# EAGLE schematic Resnik (EAGLE 9.6.1)

## Sheet 1 of 6
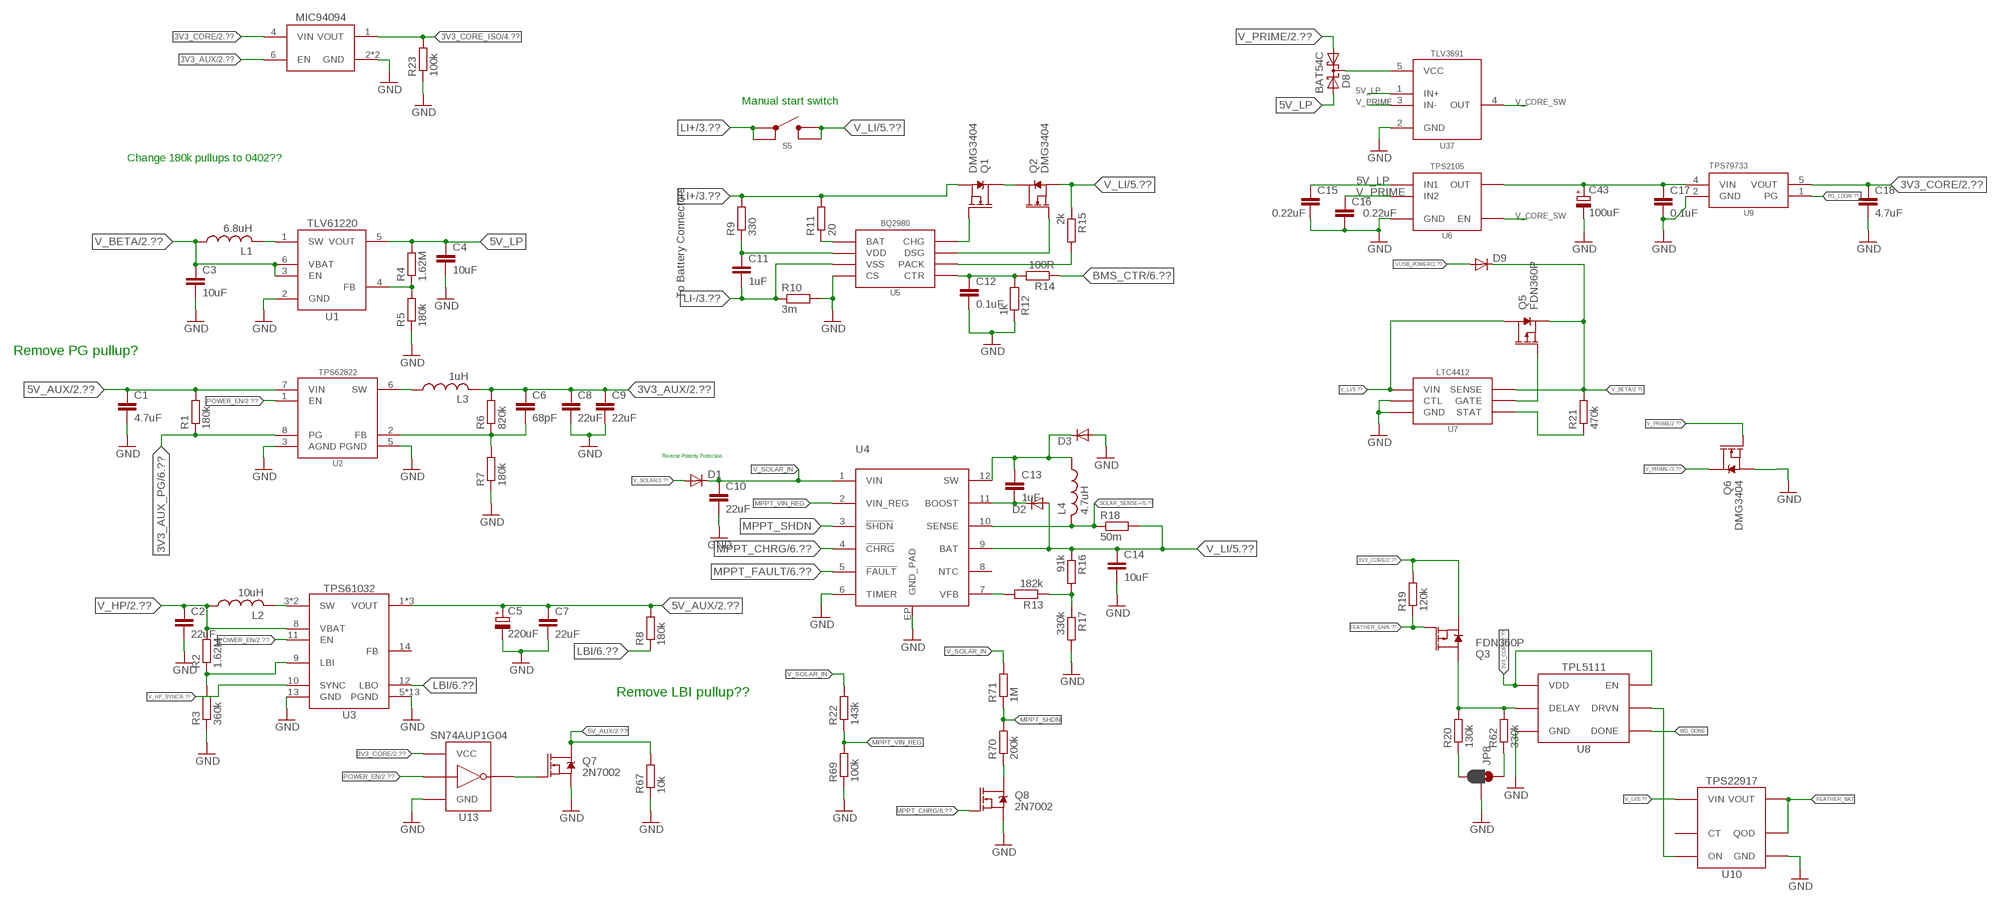
[diagram p0: schematic, sheet 1]

### Parts
C1  4.7uF  C-EU4.7UFC0805  [C0805]
C2  22uF  C-EU22UFC0805  [C0805]
C3  10uF  C-EU10UFC0805  [C0805]
C4  10uF  C-EU10UFC0805  [C0805]
C5  220uF  CTANT_EU2917  [C2917]
C6  68pF  C-EU68PFC0402  [C0402]
C7  22uF  C-EU22UFC0805  [C0805]
C8  22uF  C-EU22UFC0805  [C0805]
C9  22uF  C-EU22UFC0805  [C0805]
C10  22uF  C-EU22UFC0805  [C0805]
C11  1uF  C-EU1UFC0603  [C0603]
C12  0.1uF  C-EU0.1UFC0402  [C0402]
C13  1uF  C-EU1UFC0603  [C0603]
C14  10uF  C-EU10UFC0805  [C0805]
C15  0.22uF  C-EU0.22UFC0402  [C0402]
C16  0.22uF  C-EU0.22UFC0402  [C0402]
C17  0.1uF  C-EU0.1UFC0402  [C0402]
C18  4.7uF  C-EU4.7UFC0603  [C0603]
C43  100uF  CTANT_EU1206  [C1206_TANT]
D1  DIODEDO-214AC  [DO214AC]
D2  DIODESOD-323  [SOD323-R]
D3  DIODEDO-214AC  [DO214AC]
D8  BAT54C  [SOT23-3]
D9  DIODEDO-214AC  [DO214AC]
JP8  JUMPER-SMT_3_1-NC_PASTE_SILK  [SMT-JUMPER_3_1-NC_PASTE_SILK]
L1  6.8uH  INDUCTOR1008  [1008]
L2  10uH  INDUCTORXHMI_6.65X6.45  [WE-XHMI(6.65X6.45)]
L3  1uH  INDUCTORLQS_3X3  [WE-LQS(3X3)]
L4  4.7uH  INDUCTORMAIA_4.1X4.1  [WE-MAIA(4.1X4.1)]
Q1  DMG3404  MOSFET-NCH-DMG3404L  [SOT23-3]
Q2  DMG3404  MOSFET-NCH-DMG3404L  [SOT23-3]
Q3  FDN360P  MOSFET_PCH-FDN360P  [SOT23-3]
Q5  FDN360P  MOSFET_PCH-FDN360P  [SOT23-3]
Q6  DMG3404  MOSFET-NCH-DMG3404L  [SOT23-3]
Q7  2N7002  MOSFET-NCH-2N7002PW  [SOT323]
Q8  2N7002  MOSFET-NCH-2N7002PW  [SOT323]
R1  180k  R-EU_180KR0603  [R0603]
R2  1.62M  R-EU_1.62MR0603  [R0603]
R3  360k  R-EU_360KR0603  [R0603]
R4  1.62M  R-EU_1.62MR0603  [R0603]
R5  180k  R-EU_180KR0603  [R0603]
R6  820k  R-EU_820KR0603  [R0603]
R7  180k  R-EU_180KR0603  [R0603]
R8  180k  R-EU_180KR0603  [R0603]
R9  330  R-EU_330R0402  [R0402]
R10  3m  R-EU_0.003R0805  [R0805]
R11  20  R-EU_20R0402  [R0402]
R12  1k  R-EU_1KR0402  [R0402]
R13  182k  R-EU_182KR0603  [R0603]
R14  100R  R-EU_100R0402  [R0402]
R15  2k  R-EU_2KR0402  [R0402]
R16  91k  R-EU_91KR0603  [R0603]
R17  330k  R-EU_330KR0603  [R0603]
R18  50m  R-EU_0.05R0805  [R0805]
R19  120k  R-EU_120KR0402  [R0402]
R20  130k  R-EU_130KR0603  [R0603]
R21  470k  R-EU_470KR0603  [R0603]
R22  143k  R-EU_143KR0603  [R0603]
R23  100k  R-EU_100KR0402  [R0402]
R62  330k  R-EU_330KR0603  [R0603]
R67  10k  R-EU_10KR0402  [R0402]
R69  100k  R-EU_100KR0603  [R0603]
R70  200k  R-EU_200KR0603  [R0603]
R71  1M  R-EU_1MR0603  [R0603]
S5  BUTTON2.6X1.6  [SWITCH_2.6X1.6]
U1  TLV61220DBV  [DBV_R-PDSO-G6]
U2  TPS62822DLC  [DLC_8]
U3  TPS61032RSA  [RSA_S-PVQFN-N16]
U4  LT3652DD  [DFN_12_3X3]
U5  BQ2980RUG  [RUG_S-PQFP-N8]
U6  TPS2105  [SOT23-5]
U7  LTC4412S6  [SOT23-6L]
U8  TPL5111DDC  [DDC_R-PDSO-G6]
U9  TPS79733  [DCK_R-PDSO-G5]
U10  TPS22917DBV  [DBV_R-PDSO-G6]
U13  SN74AUP1G04YFP  [DSBGD_4]
U37  TLV3691DCK  [DCK_R-PDSO-G5]
U39  MIC94094C6  [SC-70_6]

### Nets
3V3_AUX: C6.1 C8.1 C9.1 L3.P$2 R6.2 U39.6(EN) ; also sheet 2,3,4,5
3V3_AUX_PG: R1.1 U2.8(PG) ; also sheet 6
3V3_CORE: C18.1 Q3.2(S) R19.2 U8.1(VDD) U8.6(EN) U9.5(VOUT) U13.A2(VCC) U39.4(VIN) ; also sheet 2,3,6
3V3_CORE_ISO: R23.2 U39.1(VOUT) ; also sheet 4,6
5V_AUX: C1.1 C5.+ C7.1 Q7.3(D) R1.2 R8.2 R67.2 U2.7(VIN) U3.1(VOUT) U3.15(VOUT) U3.16(VOUT) ; also sheet 2,3,4,5,6
5V_LP: C4.1 C15.1 D8.2(A2) R4.2 U1.5(VOUT) U6.5(IN1) U37.1(IN+)
BMS_CTR: R14.1 ; also sheet 6
FEATHER_BAT: U10.5(QOD) U10.6(VOUT) ; also sheet 3
FEATHER_EN: Q3.1(G) R19.1 ; also sheet 6
GND: C1.2 C2.2 C3.2 C4.2 C5.- C7.2 C8.2 C9.2 C10.2 C12.2 C14.2 C15.2 C16.2 C17.2 C18.2 C43.- D3.A JP8.2 Q6.2(S) Q7.2(S) Q8.2(S) R3.1 R5.1 R7.1 R10.2 R12.1 R17.2 R23.1 R67.1 R69.1 U1.2(GND) U2.3(AGND) U2.5(PGND) U3.5(PGND) U3.6(PGND) U3.7(PGND) U3.13(GND) U3.PAD(PGND) U3.PAD@1(PGND) U3.PAD@2(PGND) U3.PAD@3(PGND) U3.PAD@4(PGND) U3.PAD@5(PGND) U3.PAD@6(PGND) U3.PAD@7(PGND) U3.PAD@8(PGND) U3.PAD@9(PGND) U4.6(TIMER) U4.EP(GND_PAD) U5.4(CS) U6.2(GND) U7.2(GND) U7.3(CTL) U8.2(GND) U9.2(GND) U10.2(GND) U13.B1(GND) U37.2(GND) U39.2(GND) U39.5(GND) ; also sheet 2,3,4,5,6
LBI: R8.1 U3.12(LBO) ; also sheet 6
LI+: Q1.2(S) R9.2 R11.2 S5.A S5.A' ; also sheet 3
LI-: C11.2 R10.1 U5.3(VSS) ; also sheet 3,5
MPPT_CHRG: Q8.1(G) U4.4(!CHRG) ; also sheet 6
MPPT_FAULT: U4.5(!FAULT) ; also sheet 6
MPPT_SHDN: R70.2 R71.1 U4.3(!SHDN)
MPPT_VIN_REG: R22.1 R69.2 U4.2(VIN_REG)
N$2: L3.P$1 U2.6(SW)
N$3: C6.2 R6.1 R7.2 U2.2(FB)
N$4: R2.1 R3.2 U3.9(LBI)
N$5: L2.2 U3.3(SW) U3.4(SW)
N$6: Q1.3(D) Q2.3(D)
N$7: R4.1 R5.2 U1.4(FB)
N$8: Q1.1(G) U5.8(CHG)
N$9: L1.2 U1.1(SW)
N$10: Q2.1(G) U5.7(DSG)
N$11: R15.2 U5.6(PACK)
N$12: R13.1 R16.2 R17.1
N$13: C12.1 R12.2 R14.2 U5.5(CTR)
N$14: R11.1 U5.1(BAT)
N$15: R13.2 U4.7(VFB)
N$16: C11.1 R9.1 U5.2(VDD)
N$18: C13.2 D2.C U4.11(BOOST)
N$19: JP8.3 R20.1
N$20: C13.1 D3.C L4.P$1 U4.12(SW)
N$22: Q8.3(D) R70.1
N$42: JP8.1 R62.1
N$45: Q5.1(G) U7.5(GATE)
N$46: R21.1 U7.4(STAT)
N$63: Q3.3(D) R20.2 R62.2 U8.3(DELAY)
N$64: U8.5(DRVN) U10.3(ON)
N$68: Q7.1(G) U13.B2(Y)
N$69: D8.3(C) U37.5(VCC)
PG_LDO: U9.1(PG) ; also sheet 6
POWER_EN: U2.1(EN) U3.11(EN) U13.A1(A) ; also sheet 2
SOLAR_SENSE+: L4.P$2 R18.1 U4.10(SENSE) ; also sheet 5
V_BETA: C3.1 D9.C L1.1 Q5.2(S) R21.2 U1.3(EN) U1.6(VBAT) U7.6(SENSE) ; also sheet 2
V_CORE: C17.1 C43.+ U6.4(OUT) U9.4(VIN)
V_CORE_SW: U6.1(EN) U37.4(OUT)
V_HP: C2.1 L2.1 R2.2 U3.8(VBAT) ; also sheet 2
V_HP_SYNC: U3.10(SYNC) ; also sheet 6
V_LI: C14.1 D2.A Q2.2(S) Q5.3(D) R15.1 R16.1 R18.2 S5.B S5.B' U4.9(BAT) U7.1(VIN) U10.1(VIN) ; also sheet 5
V_PRIME: C16.1 D8.1(A1) Q6.1(G) U6.3(IN2) U37.3(IN-) ; also sheet 2,3,5
V_PRIME-: Q6.3(D) ; also sheet 3
V_SOLAR: D1.A ; also sheet 3
V_SOLAR_IN: C10.1 D1.C R22.2 R71.2 U4.1(VIN)
VUSB_POWER: D9.A ; also sheet 2,6
WD_DONE: U8.4(DONE) ; also sheet 3
Unconnected: U3.14(FB) U4.8(NTC) U10.4(CT)

### Notes on the sheet
- Manual start switch
- Change 180k pullups to 0402??
- To Battery Connectors
- Remove PG pullup?
- Reverse Polarity Protection
- Remove LBI pullup??

## Sheet 2 of 6
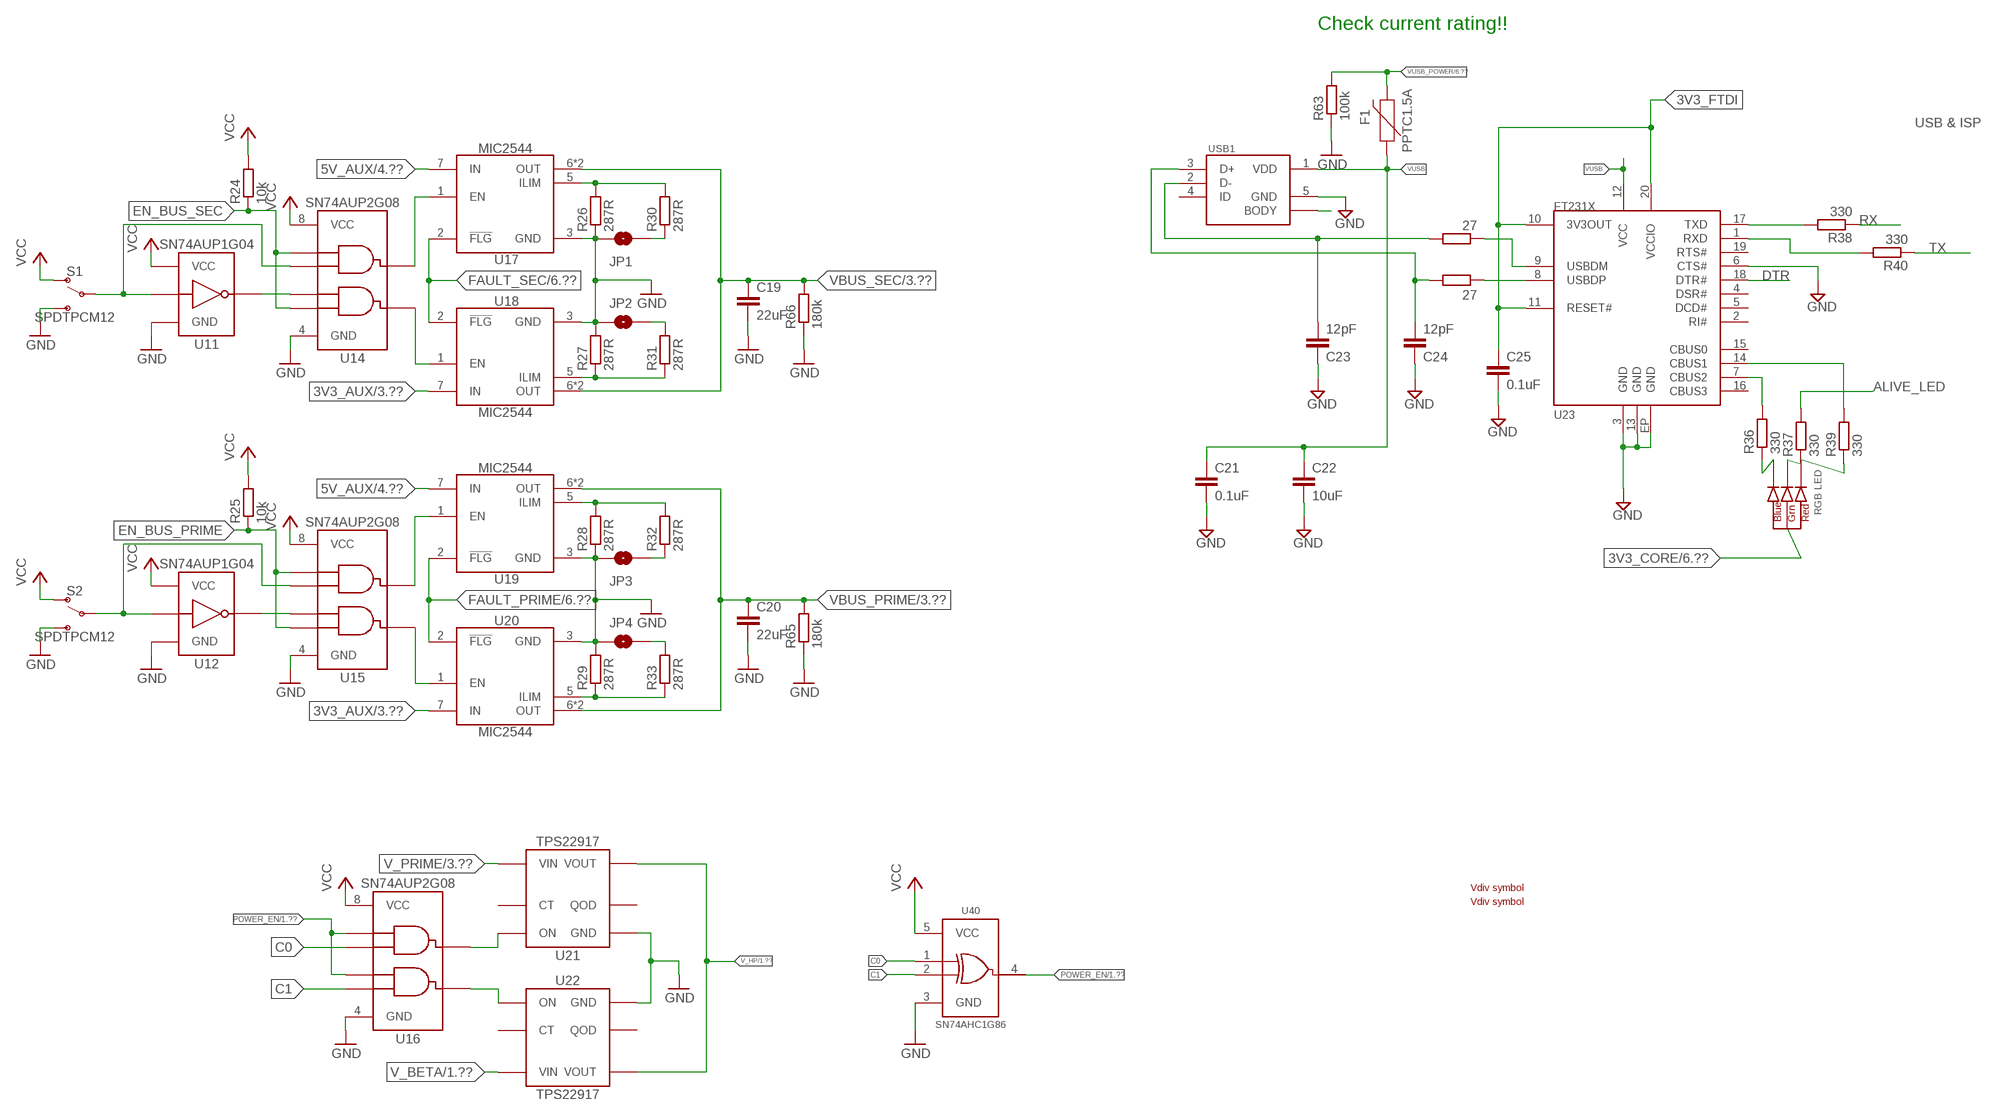
[diagram p1: schematic, sheet 2]

### Parts
C19  22uF  C-EU22UFC0805  [C0805]
C20  22uF  C-EU22UFC0805  [C0805]
C21  0.1uF  C-EU0.1UFC0402  [C0402]
C22  10uF  C-EU10UFC0805  [C0805]
C23  12pF  C-EU12PFC0402  [C0402]
C24  12pF  C-EU12PFC0402  [C0402]
C25  0.1uF  C-EU0.1UFC0402  [C0402]
D4  CLVBA-FKA  [CLVBA-FKA]
F1  PPTC1.5A  [1206]
JP1  JUMPER-SMT_2_NO_SILK  [SMT-JUMPER_2_NO_SILK]
JP2  JUMPER-SMT_2_NO_SILK  [SMT-JUMPER_2_NO_SILK]
JP3  JUMPER-SMT_2_NO_SILK  [SMT-JUMPER_2_NO_SILK]
JP4  JUMPER-SMT_2_NO_SILK  [SMT-JUMPER_2_NO_SILK]
R24  10k  R-EU_10KR0402  [R0402]
R25  10k  R-EU_10KR0402  [R0402]
R26  287R  R-EU_232R0402  [R0402]
R27  287R  R-EU_232R0402  [R0402]
R28  287R  R-EU_232R0402  [R0402]
R29  287R  R-EU_232R0402  [R0402]
R30  287R  R-EU_453R0402  [R0402]
R31  287R  R-EU_453R0402  [R0402]
R32  287R  R-EU_453R0402  [R0402]
R33  287R  R-EU_453R0402  [R0402]
R34  27  R-EU_27R0402  [R0402]
R35  27  R-EU_27R0402  [R0402]
R36  330  R-EU_330R0402  [R0402]
R37  330  R-EU_330R0402  [R0402]
R38  330  R-EU_330R0402  [R0402]
R39  330  R-EU_330R0402  [R0402]
R40  330  R-EU_330R0402  [R0402]
R63  100k  R-EU_100KR0402  [R0402]
R65  180k  R-EU_180KR0402  [R0402]
R66  180k  R-EU_180KR0402  [R0402]
S1  SPDTPCM12  [PCM12]
S2  SPDTPCM12  [PCM12]
U11  SN74AUP1G04YFP  [DSBGD_4]
U12  SN74AUP1G04YFP  [DSBGD_4]
U14  SN74AUP2G08DQE  [DQE_R-PX2SON-N8]
U15  SN74AUP2G08DQE  [DQE_R-PX2SON-N8]
U16  SN74AUP2G08DQE  [DQE_R-PX2SON-N8]
U17  MIC2544MSOP  [MSOP_8]
U18  MIC2544MSOP  [MSOP_8]
U19  MIC2544MSOP  [MSOP_8]
U20  MIC2544MSOP  [MSOP_8]
U21  TPS22917DBV  [DBV_R-PDSO-G6]
U22  TPS22917DBV  [DBV_R-PDSO-G6]
U23  FT231X-Q  [QFN20]
U40  SN74AHC1G86DCK  [DCK_R-PDSO-G5]
U$1  VDIV-JP  [VDIV_GENERIC]
U$2  VDIV-JP  [VDIV_GENERIC]
USB1  MICRO_USB_LONGPADS  [10118194-0001LF_10118194-0001LF_LONGER_PADS]

### Nets
3V3_AUX: R24.2 R25.2 S1.1(O) S2.1(O) U11.A2(VCC) U12.A2(VCC) U14.8(VCC) U15.8(VCC) U18.7(IN) U20.7(IN) ; supply symbol labelled VCC ; also sheet 1,3,4,5
3V3_CORE: D4.2(ANODE) U16.8(VCC) U40.5(VCC) ; supply symbol labelled VCC ; also sheet 1,3,6
3V3_FTDI: C25.1 U23.10(3V3OUT) U23.11(RESET#) U23.20(VCCIO)
5V_AUX: U17.7(IN) U19.7(IN) ; also sheet 1,3,4,5,6
ALIVE_LED: R37.2 ; also sheet 6
C0: U16.2(B1) U40.1(A) ; also sheet 6
C1: U16.6(B2) U40.2(B) ; also sheet 6
DTR: U23.18(DTR#) ; also sheet 6
EN_BUS_PRIME: R25.1 U15.1(A1) U15.6(B2) ; also sheet 6
EN_BUS_SEC: R24.1 U14.1(A1) U14.6(B2) ; also sheet 6
FAULT_PRIME: U19.2(!FLG) U20.2(!FLG) ; also sheet 6
FAULT_SEC: U17.2(!FLG) U18.2(!FLG) ; also sheet 6
GND: C19.2 C20.2 C21.2 C22.2 C23.1 C24.1 C25.2 JP1.1 JP2.1 JP3.1 JP4.1 R26.1 R27.2 R28.1 R29.2 R63.1 R65.1 R66.1 S1.3(S) S2.3(S) U11.B1(GND) U12.B1(GND) U14.4(GND) U15.4(GND) U16.4(GND) U17.3(GND) U18.3(GND) U19.3(GND) U20.3(GND) U21.2(GND) U22.2(GND) U23.3(GND) U23.6(CTS#) U23.13(GND) U23.EP(GND) U40.3(GND) USB1.5(GND) ; also sheet 1,3,4,5,6
N$1: USB1.BODY@1(BODY) USB1.BODY@2(BODY) USB1.BODY@3(BODY) USB1.BODY@4(BODY) USB1.BODY@7(BODY) USB1.BODY@8(BODY)
N$23: U16.7(Y1) U21.3(ON)
N$24: U16.3(Y2) U22.3(ON)
N$26: U12.B2(Y) U15.5(A2)
N$27: R28.2 R32.2 U19.5(ILIM)
N$28: S2.2(P) U12.A1(A) U15.2(B1)
N$29: U15.7(Y1) U19.1(EN)
N$30: U15.3(Y2) U20.1(EN)
N$31: JP3.2 R32.1
N$32: JP4.2 R33.2
N$33: R29.1 R33.1 U20.5(ILIM)
N$34: U11.B2(Y) U14.5(A2)
N$35: S1.2(P) U11.A1(A) U14.2(B1)
N$36: U14.7(Y1) U17.1(EN)
N$37: U14.3(Y2) U18.1(EN)
N$38: R26.2 R30.2 U17.5(ILIM)
N$39: JP1.2 R30.1
N$40: JP2.2 R31.2
N$41: R27.1 R31.1 U18.5(ILIM)
N$44: R38.2 U23.17(TXD)
N$47: R40.2 U23.1(RXD)
N$48: C24.2 R35.2 USB1.3(D+)
N$49: C23.2 R34.2 USB1.2(D-)
N$50: R35.1 U23.8(USBDP)
N$51: R39.2 U23.14(CBUS1)
N$52: R34.1 U23.9(USBDM)
N$53: D4.1(RED_CATH) R39.1
N$54: D4.3(BLUE_CATH) R36.1
N$56: D4.4(GREEN_CATH) R37.1
N$57: R36.2 U23.7(CBUS2)
POWER_EN: U16.1(A1) U16.5(A2) U40.4(Y) ; also sheet 1
RX: R38.1 ; also sheet 3,6
TX: R40.1 ; also sheet 3,6
V_BETA: U22.1(VIN) ; also sheet 1
V_HP: U21.6(VOUT) U22.6(VOUT) ; also sheet 1
V_PRIME: U21.1(VIN) ; also sheet 1,3,5
VBUS_PRIME: C20.1 R65.2 U19.6(OUT) U19.8(OUT) U20.6(OUT) U20.8(OUT) ; also sheet 3,4
VBUS_SEC: C19.1 R66.2 U17.6(OUT) U17.8(OUT) U18.6(OUT) U18.8(OUT) ; also sheet 3,4
VUSB: C21.1 C22.1 F1.1 U23.12(VCC) USB1.1(VDD)
VUSB_POWER: F1.2 R63.2 ; also sheet 1,6
Unconnected: U21.4(CT) U22.4(CT) U23.2(RI#) U23.4(DSR#) U23.5(DCD#) U23.15(CBUS0) U23.16(CBUS3) U23.19(RTS#) USB1.4(ID)

### Notes on the sheet
- Check current rating!!
- USB & ISP

## Sheet 3 of 6
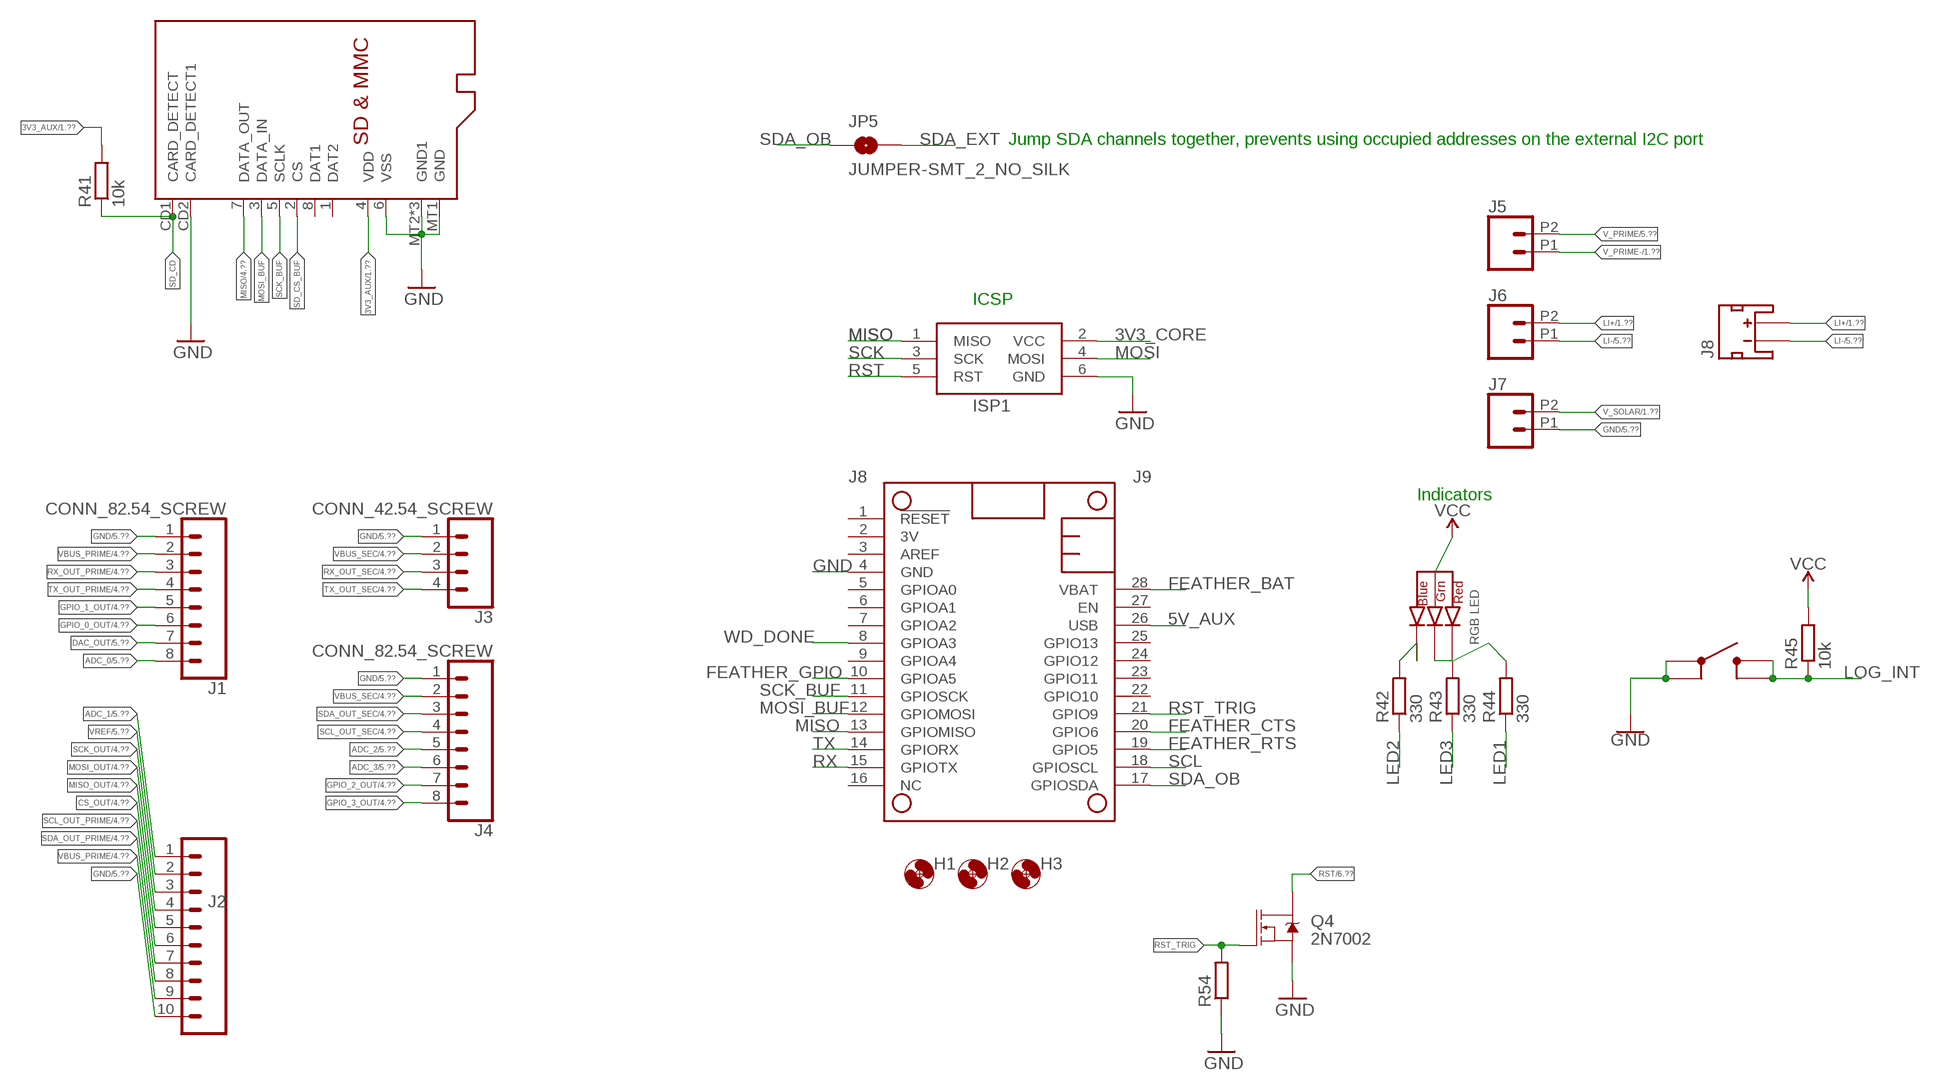
[diagram p2: schematic, sheet 3]

### Parts
D5  CLVBA-FKA  [CLVBA-FKA]
H1  MOUNTING_HOLE4_NP  [4_40]
H2  MOUNTING_HOLE4_NP  [4_40]
H3  MOUNTING_HOLE4_NP  [4_40]
ISP1  AVRISP-6  [AVRISP]
J1  CONN_82.54_SCREW  [1X08_SCREW]
J2  CONN_102.54_SCREW  [1X10_SCREW]
J3  CONN_42.54_SCREW  [1X04_SCREW]
J4  CONN_82.54_SCREW  [1X08_SCREW]
J5  CONN_022.54_SCREW  [1X02_2.54_SCREWTERM]
J6  CONN_022.54_SCREW  [1X02_2.54_SCREWTERM]
J7  CONN_022.54_SCREW  [1X02_2.54_SCREWTERM]
J8  JST_2MM_MALE  [JST-2-SMD]
JP5  JUMPER-SMT_2_NO_SILK  [SMT-JUMPER_2_NO_SILK]
MS1  FEATHERWINGLAYOUT  [FEATHERWING_MIN]
Q4  2N7002  MOSFET-NCH-2N7002PW  [SOT323]
R41  10k  R-EU_10KR0402  [R0402]
R42  330  R-EU_330R0402  [R0402]
R43  330  R-EU_330R0402  [R0402]
R44  330  R-EU_330R0402  [R0402]
R45  10k  R-EU_10KR0402  [R0402]
R54  R-EU_10KR0402  [R0402]
S3  BUTTON4.2X3.2  [SWITCH_4.2X3.2]
SD1  MICROSDCD  [MICROSD_CD]

### Nets
3V3_AUX: R41.2 SD1.4(VDD) ; also sheet 1,2,4,5
3V3_CORE: D5.2(ANODE) ISP1.2(VCC) R45.2 ; supply symbol labelled VCC ; also sheet 1,2,6
5V_AUX: MS1.26(USB) ; also sheet 1,2,4,5,6
ADC_0: J1.8 ; also sheet 5
ADC_1: J2.1 ; also sheet 5
ADC_2: J4.5 ; also sheet 5
ADC_3: J4.6 ; also sheet 5
CS_OUT: J2.6 ; also sheet 4
DAC_OUT: J1.7 ; also sheet 5
FEATHER_BAT: MS1.28(VBAT) ; also sheet 1
FEATHER_CTS: MS1.20(GPIO6) ; also sheet 6
FEATHER_GPIO: MS1.10(GPIOA5) ; also sheet 6
FEATHER_RTS: MS1.19(GPIO5) ; also sheet 6
GND: ISP1.6(GND) J1.1 J2.10 J3.1 J4.1 J7.P1 MS1.4(GND) Q4.2(S) R54.1 S3.1 S3.2 SD1.6(VSS) SD1.CD2(CARD_DETECT1) SD1.MT1(GND) SD1.MT2(GND1) SD1.MT3(GND1) SD1.MT4(GND1) ; also sheet 1,2,4,5,6
GPIO_0_OUT: J1.6 ; also sheet 4
GPIO_1_OUT: J1.5 ; also sheet 4
GPIO_2_OUT: J4.7 ; also sheet 4
GPIO_3_OUT: J4.8 ; also sheet 4
LED1: R44.1 ; also sheet 6
LED2: R42.1 ; also sheet 6
LED3: R43.1 ; also sheet 6
LI+: J6.P2 J8.2(+) ; also sheet 1
LI-: J6.P1 J8.1(-) ; also sheet 1,5
LOG_INT: R45.1 S3.3 S3.4 ; also sheet 6
MISO: ISP1.1(MISO) MS1.13(GPIOMISO) SD1.7(DATA_OUT) ; also sheet 4,6
MISO_OUT: J2.5 ; also sheet 4
MOSI: ISP1.4(MOSI) ; also sheet 4,6
MOSI_BUF: MS1.12(GPIOMOSI) SD1.3(DATA_IN) ; also sheet 4
MOSI_OUT: J2.4 ; also sheet 4
N$58: D5.3(BLUE_CATH) R42.2
N$59: D5.4(GREEN_CATH) R43.2
N$60: D5.1(RED_CATH) R44.2
RST: ISP1.5(RST) Q4.3(D) ; also sheet 6
RST_TRIG: MS1.21(GPIO9) Q4.1(G) R54.2
RX: MS1.15(GPIOTX) ; also sheet 2,6
RX_OUT_PRIME: J1.3 ; also sheet 4
RX_OUT_SEC: J3.3 ; also sheet 4
SCK: ISP1.3(SCK) ; also sheet 4,6
SCK_BUF: MS1.11(GPIOSCK) SD1.5(SCLK) ; also sheet 4
SCK_OUT: J2.3 ; also sheet 4
SCL: MS1.18(GPIOSCL) ; also sheet 4,5,6
SCL_OUT_PRIME: J2.7 ; also sheet 4
SCL_OUT_SEC: J4.4 ; also sheet 4
SD_CD: R41.1 SD1.CD1(CARD_DETECT) ; also sheet 6
SD_CS_BUF: SD1.2(CS) ; also sheet 4
SDA_EXT: JP5.2 ; also sheet 4
SDA_OB: JP5.1 MS1.17(GPIOSDA) ; also sheet 4,5,6
SDA_OUT_PRIME: J2.8 ; also sheet 4
SDA_OUT_SEC: J4.3 ; also sheet 4
TX: MS1.14(GPIORX) ; also sheet 2,6
TX_OUT_PRIME: J1.4 ; also sheet 4
TX_OUT_SEC: J3.4 ; also sheet 4
V_PRIME: J5.P2 ; also sheet 1,2,5
V_PRIME-: J5.P1 ; also sheet 1
V_SOLAR: J7.P2 ; also sheet 1
VBUS_PRIME: J1.2 J2.9 ; also sheet 2,4
VBUS_SEC: J3.2 J4.2 ; also sheet 2,4
VREF: J2.2 ; also sheet 5
WD_DONE: MS1.8(GPIOA3) ; also sheet 1
Unconnected: J8.NC1(PAD1) J8.NC2(PAD2) MS1.1(!RESET) MS1.2(3V) MS1.3(AREF) MS1.5(GPIOA0) MS1.6(GPIOA1) MS1.7(GPIOA2) MS1.9(GPIOA4) MS1.16(NC) MS1.22(GPIO10) MS1.23(GPIO11) MS1.24(GPIO12) MS1.25(GPIO13) MS1.27(EN) SD1.1(DAT2) SD1.8(DAT1)

### Notes on the sheet
- Jump SDA channels together, prevents using occupied addresses on the external I2C port
- ICSP
- J8 | J9
- Indicators

## Sheet 4 of 6
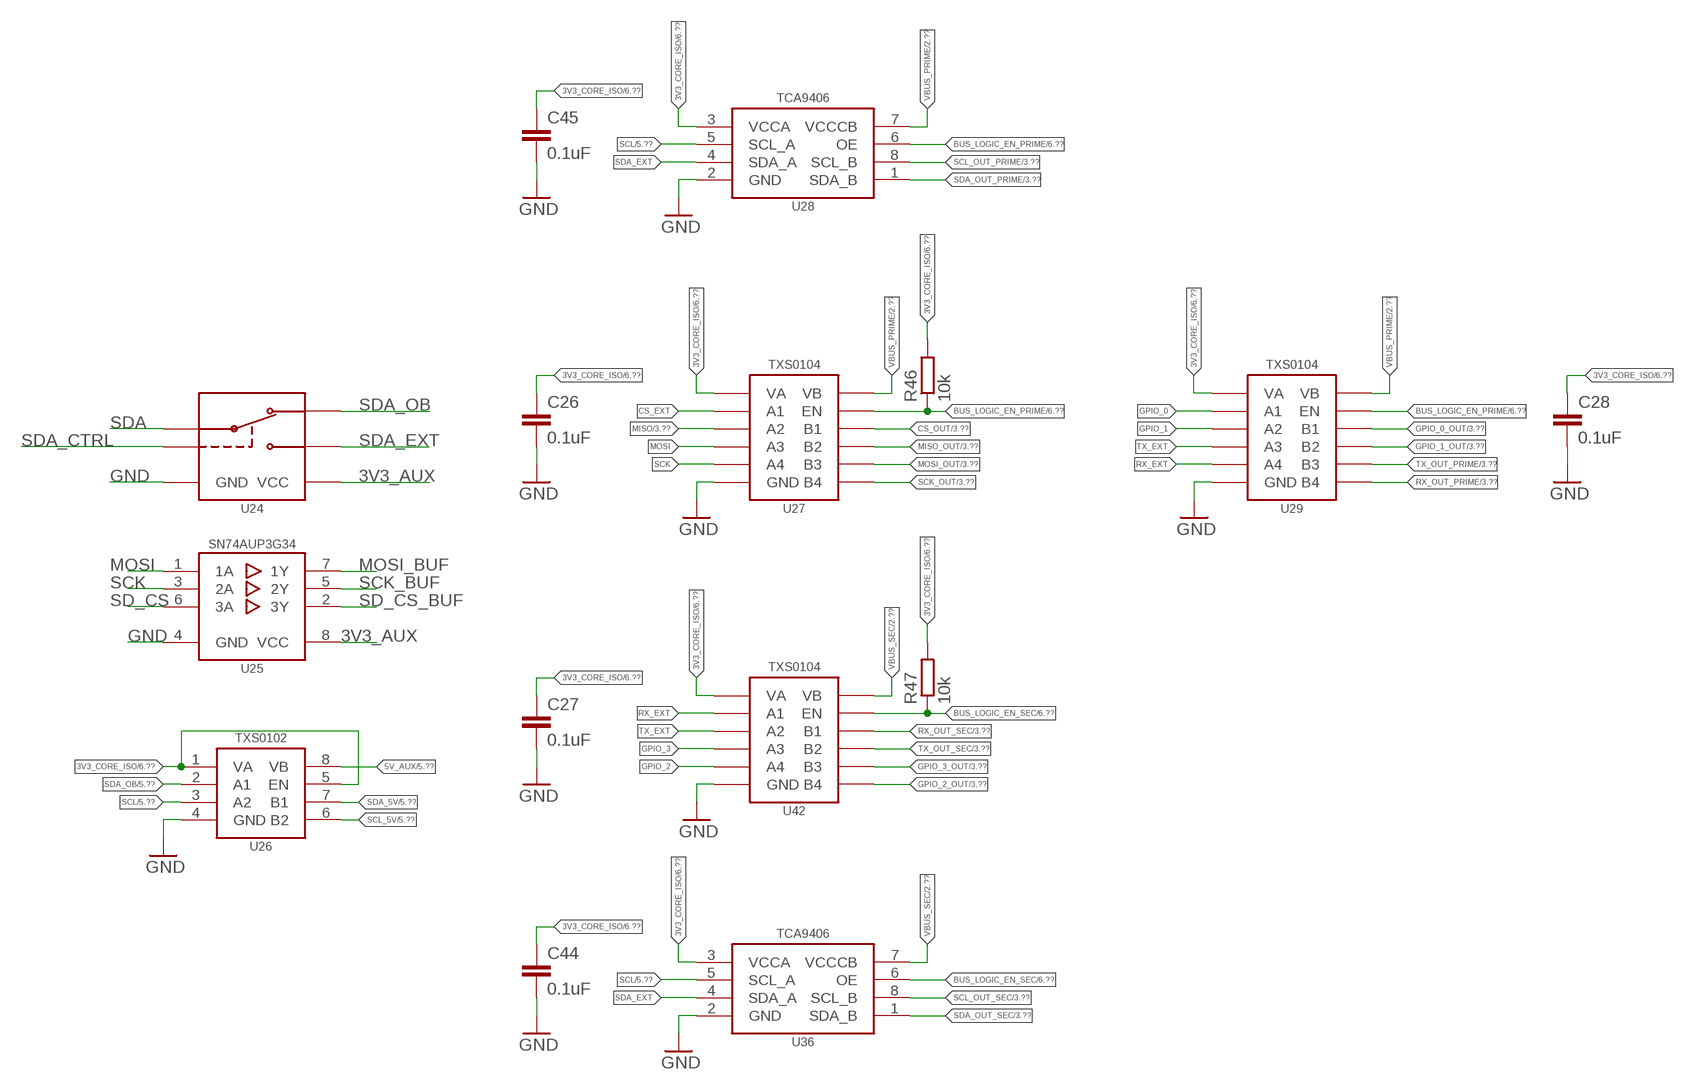
[diagram p3: schematic, sheet 4]

### Parts
C26  0.1uF  C-EU0.1UFC0402  [C0402]
C27  0.1uF  C-EU0.1UFC0402  [C0402]
C28  0.1uF  C-EU0.1UFC0402  [C0402]
C44  0.1uF  C-EU0.1UFC0402  [C0402]
C45  0.1uF  C-EU0.1UFC0402  [C0402]
R46  10k  R-EU_10KR0402  [R0402]
R47  10k  R-EU_10KR0402  [R0402]
U24  SN74LVC1G3157DRL  [DRL_R-PDSO-N6]
U25  SN74AUP3G34DCU  [DCU_(R-PDSO-G8)]
U26  TXS0102DQM  [DQM_R-PX2SON-N8]
U27  TXS0104RGY  [RGY_S-PVQFN-N14]
U28  TCA9406DCU  [DCU_(R-PDSO-G8)]
U29  TXS0104RGY  [RGY_S-PVQFN-N14]
U36  TCA9406DCU  [DCU_(R-PDSO-G8)]
U42  TXS0104RGY  [RGY_S-PVQFN-N14]

### Nets
3V3_AUX: U24.5(VCC) U25.8(VCC) ; also sheet 1,2,3,5
3V3_CORE_ISO: C26.1 C27.1 C28.1 C44.1 C45.1 R46.2 R47.2 U26.1(VA) U26.5(EN) U27.1(VA) U28.3(VCCA) U29.1(VA) U36.3(VCCA) U42.1(VA) ; also sheet 1,6
5V_AUX: U26.8(VB) ; also sheet 1,2,3,5,6
BUS_LOGIC_EN_PRIME: R46.1 U27.8(EN) U28.6(OE) U29.8(EN) ; also sheet 6
BUS_LOGIC_EN_SEC: R47.1 U36.6(OE) U42.8(EN) ; also sheet 6
CS_EXT: U27.2(A1) ; also sheet 6
CS_OUT: U27.13(B1) ; also sheet 3
GND: C26.2 C27.2 C28.2 C44.2 C45.2 U24.2(GND) U25.4(GND) U26.4(GND) U27.7(GND) U27.EP(GND) U28.2(GND) U29.7(GND) U29.EP(GND) U36.2(GND) U42.7(GND) U42.EP(GND) ; also sheet 1,2,3,5,6
GPIO_0: U29.2(A1) ; also sheet 6
GPIO_0_OUT: U29.13(B1) ; also sheet 3
GPIO_1: U29.3(A2) ; also sheet 6
GPIO_1_OUT: U29.12(B2) ; also sheet 3
GPIO_2: U42.5(A4) ; also sheet 6
GPIO_2_OUT: U42.10(B4) ; also sheet 3
GPIO_3: U42.4(A3) ; also sheet 6
GPIO_3_OUT: U42.11(B3) ; also sheet 3
MISO: U27.3(A2) ; also sheet 3,6
MISO_OUT: U27.12(B2) ; also sheet 3
MOSI: U25.1(1A) U27.4(A3) ; also sheet 3,6
MOSI_BUF: U25.7(1Y) ; also sheet 3
MOSI_OUT: U27.11(B3) ; also sheet 3
RX_EXT: U29.5(A4) U42.2(A1) ; also sheet 6
RX_OUT_PRIME: U29.10(B4) ; also sheet 3
RX_OUT_SEC: U42.13(B1) ; also sheet 3
SCK: U25.3(2A) U27.5(A4) ; also sheet 3,6
SCK_BUF: U25.5(2Y) ; also sheet 3
SCK_OUT: U27.10(B4) ; also sheet 3
SCL: U26.3(A2) U28.5(SCL_A) U36.5(SCL_A) ; also sheet 3,5,6
SCL_5V: U26.6(B2) ; also sheet 5
SCL_OUT_PRIME: U28.8(SCL_B) ; also sheet 3
SCL_OUT_SEC: U36.8(SCL_B) ; also sheet 3
SD_CS: U25.6(3A) ; also sheet 6
SD_CS_BUF: U25.2(3Y) ; also sheet 3
SDA: U24.4(A) ; also sheet 6
SDA_5V: U26.7(B1) ; also sheet 5
SDA_CTRL: U24.6(S) ; also sheet 6
SDA_EXT: U24.1(B2) U28.4(SDA_A) U36.4(SDA_A) ; also sheet 3
SDA_OB: U24.3(B1) U26.2(A1) ; also sheet 3,5,6
SDA_OUT_PRIME: U28.1(SDA_B) ; also sheet 3
SDA_OUT_SEC: U36.1(SDA_B) ; also sheet 3
TX_EXT: U29.4(A3) U42.3(A2) ; also sheet 6
TX_OUT_PRIME: U29.11(B3) ; also sheet 3
TX_OUT_SEC: U42.12(B2) ; also sheet 3
VBUS_PRIME: U27.14(VB) U28.7(VCCCB) U29.14(VB) ; also sheet 2,3
VBUS_SEC: U36.7(VCCCB) U42.14(VB) ; also sheet 2,3

## Sheet 5 of 6
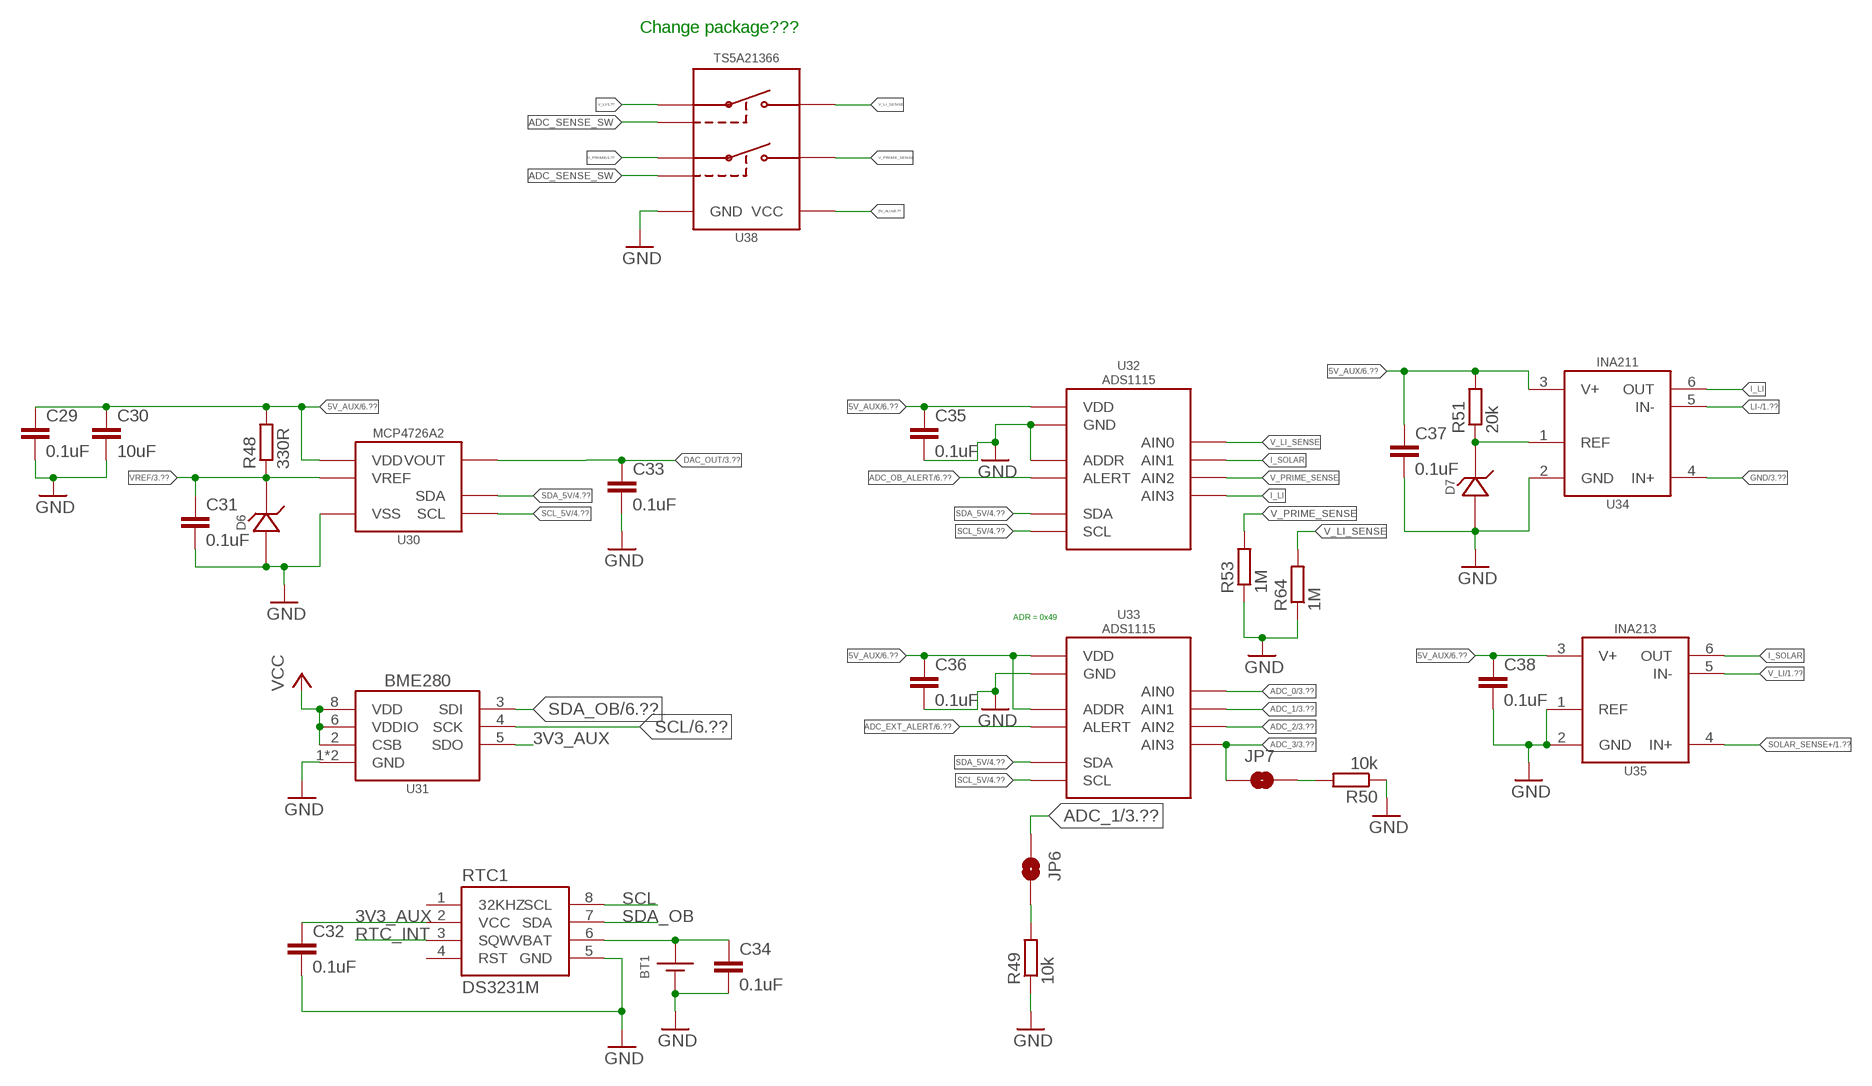
[diagram p4: schematic, sheet 5]

### Parts
BT1  BATTERY_COIN12MM  [LINX_BAT-HLD-012-SMT]
C29  0.1uF  C-EU0.1UFC0402  [C0402]
C30  10uF  C-EU10UFC0805  [C0805]
C31  0.1uF  C-EU0.1UFC0402  [C0402]
C32  0.1uF  C-EU0.1UFC0402  [C0402]
C33  0.1uF  C-EU0.1UFC0402  [C0402]
C34  0.1uF  C-EU0.1UFC0402  [C0402]
C35  0.1uF  C-EU0.1UFC0402  [C0402]
C36  0.1uF  C-EU0.1UFC0402  [C0402]
C37  0.1uF  C-EU0.1UFC0402  [C0402]
C38  0.1uF  C-EU0.1UFC0402  [C0402]
D6  LM40402.5  [SOT23-3]
D7  LM40402.5  [SOT23-3]
JP6  JUMPER-SMT_2_NO_SILK  [SMT-JUMPER_2_NO_SILK]
JP7  JUMPER-SMT_2_NO_SILK  [SMT-JUMPER_2_NO_SILK]
R48  330R  R-EU_330R0603  [R0603]
R49  10k  R-EU_P10KR0603  [R0603]
R50  10k  R-EU_P10KR0603  [R0603]
R51  20k  R-EU_20KR0603  [R0603]
R53  1M  R-EU_1MR0402  [R0402]
R64  1M  R-EU_1MR0402  [R0402]
RTC1  DS3231M  [SO08]
U30  MCP4726A2SOT-23  [SOT23-6L]
U31  BME280  [BME280]
U32  ADS1115  [VSSOP_10]
U33  ADS1115  [VSSOP_10]
U34  INA211DCK  [DCK_R-PDSO-G6]
U35  INA213DCK  [DCK_R-PDSO-G6]
U38  TS5A21366RSE  [RSE0008A]

### Nets
3V3_AUX: C32.1 RTC1.2(VCC) U31.2(CSB) U31.5(SDO) U31.6(VDDIO) U31.8(VDD) ; supply symbol labelled VCC ; also sheet 1,2,3,4
5V_AUX: C29.1 C30.1 C35.1 C36.1 C37.1 C38.1 R48.2 R51.2 U30.3(VDD) U32.8(VDD) U33.1(ADDR) U33.8(VDD) U34.3(V+) U35.3(V+) U38.2(VCC) ; also sheet 1,2,3,4,6
ADC_0: U33.4(AIN0) ; also sheet 3
ADC_1: JP6.1 U33.5(AIN1) ; also sheet 3
ADC_2: U33.6(AIN2) ; also sheet 3
ADC_3: JP7.1 U33.7(AIN3) ; also sheet 3
ADC_EXT_ALERT: U33.2(ALERT) ; also sheet 6
ADC_OB_ALERT: U32.2(ALERT) ; also sheet 6
ADC_SENSE_SW: U38.3(S1) U38.7(S2) ; also sheet 6
DAC_OUT: C33.1 U30.1(VOUT) ; also sheet 3
GND: BT1.GND(-) C29.2 C30.2 C31.2 C32.2 C33.2 C34.2 C35.2 C36.2 C37.2 C38.2 D6.2(A) D7.2(A) R49.1 R50.1 R53.1 R64.1 RTC1.5(GND) U30.2(VSS) U31.1(GND) U31.7(GND) U32.1(ADDR) U32.3(GND) U33.3(GND) U34.2(GND) U34.4(IN+) U35.1(REF) U35.2(GND) U38.6(GND) ; also sheet 1,2,3,4,6
I_LI: U32.7(AIN3) U34.6(OUT)
I_SOLAR: U32.5(AIN1) U35.6(OUT)
LI-: U34.5(IN-) ; also sheet 1,3
N$21: D7.1(C) R51.1 U34.1(REF)
N$43: BT1.POWER0(+) BT1.POWER1(+) C34.1 RTC1.6(VBAT)
N$65: JP6.2 R49.2
N$66: JP7.2 R50.2
RTC_INT: RTC1.3(SQW) ; also sheet 6
SCL: RTC1.8(SCL) U31.4(SCK) ; also sheet 3,4,6
SCL_5V: U30.5(SCL) U32.10(SCL) U33.10(SCL) ; also sheet 4
SDA_5V: U30.4(SDA) U32.9(SDA) U33.9(SDA) ; also sheet 4
SDA_OB: RTC1.7(SDA) U31.3(SDI) ; also sheet 3,4,6
SOLAR_SENSE+: U35.4(IN+) ; also sheet 1
V_LI: U35.5(IN-) U38.8(A1) ; also sheet 1
V_LI_SENSE: R64.2 U32.4(AIN0) U38.1(B1)
V_PRIME: U38.4(A2) ; also sheet 1,2,3
V_PRIME_SENSE: R53.2 U32.6(AIN2) U38.5(B2)
VREF: C31.1 D6.1(C) R48.1 U30.6(VREF) ; also sheet 3
Unconnected: RTC1.1(32KHZ) RTC1.4(RST)

### Notes on the sheet
- Change package???
- ADR = 0x49

## Sheet 6 of 6
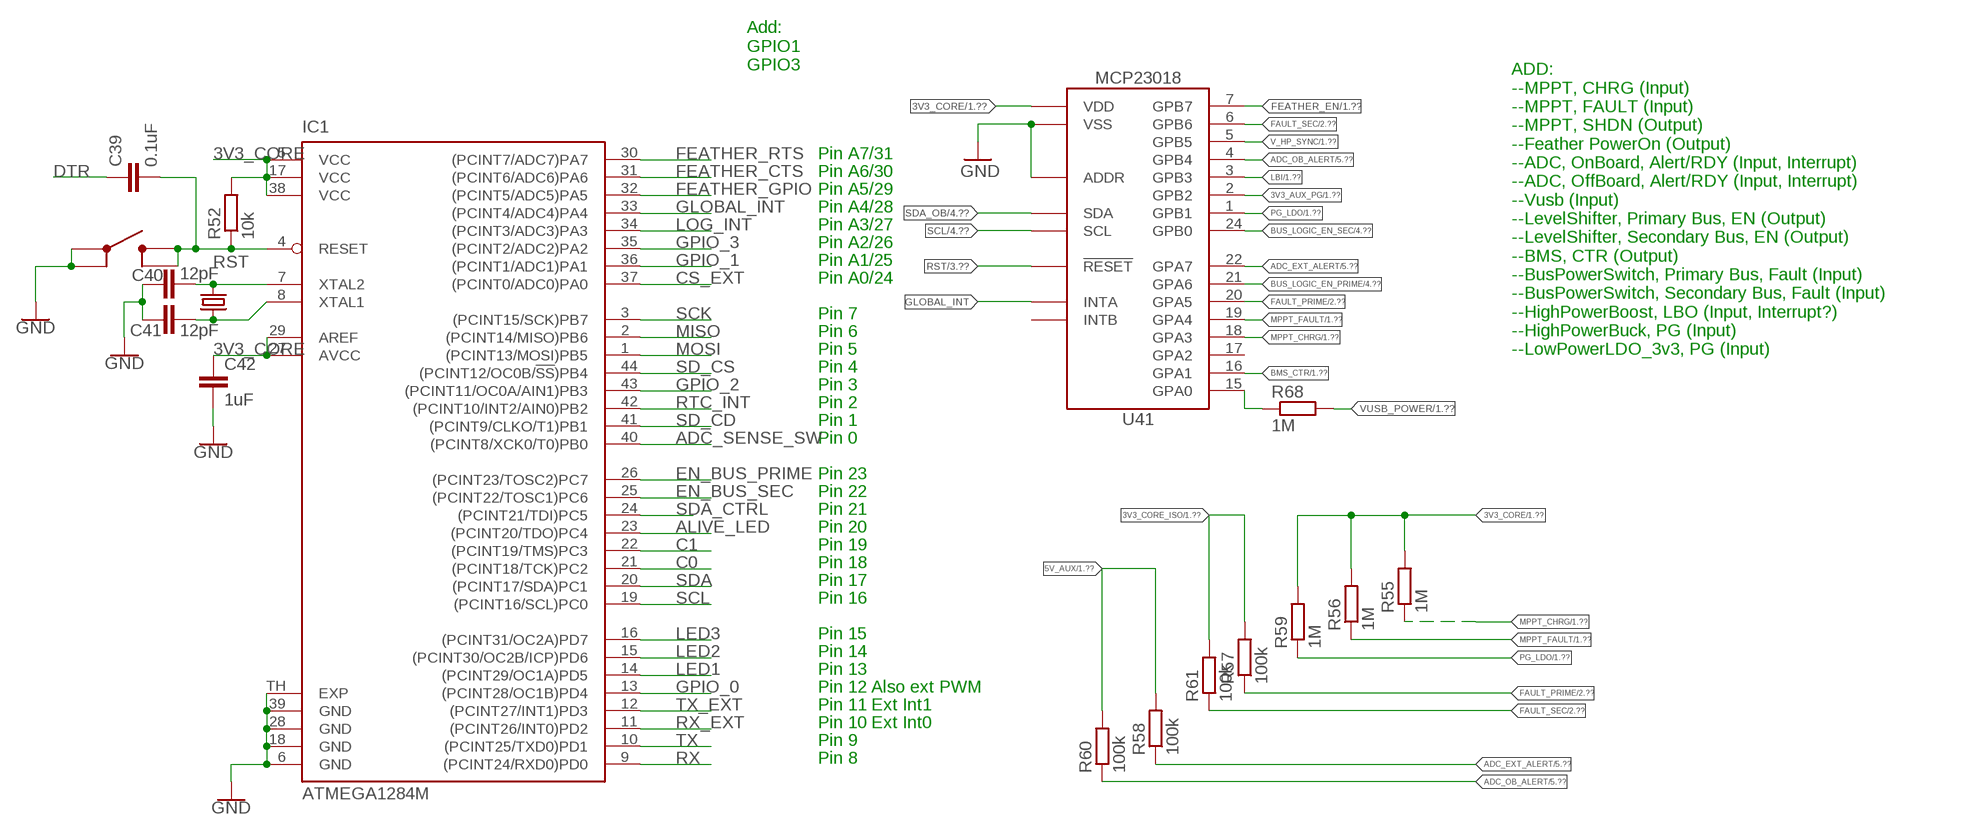
[diagram p5: schematic, sheet 6]

### Parts
C39  0.1uF  C-EU0.1UFC0402  [C0402]
C40  12pF  C-EU12PFC0402  [C0402]
C41  12pF  C-EU12PFC0402  [C0402]
C42  1uF  C-EU0.1UFC0402  [C0402]
IC1  ATMEGA1284M  [MLF44-TH]
R52  10k  R-EU_10KR0402  [R0402]
R55  1M  R-EU_1MR0402  [R0402]
R56  1M  R-EU_1MR0402  [R0402]
R57  100k  R-EU_100KR0402  [R0402]
R58  100k  R-EU_100KR0402  [R0402]
R59  1M  R-EU_1MR0402  [R0402]
R60  100k  R-EU_100KR0402  [R0402]
R61  100k  R-EU_100KR0402  [R0402]
R68  1M  R-EU_1MR0402  [R0402]
S4  BUTTON4.2X3.2  [SWITCH_4.2X3.2]
U41  MCP23018QFN  [QFN24]
XTAL1  CRYSTAL8MHZ5X3.2  [CRYSTAL_5X3.2_2-SMD]

### Nets
3V3_AUX_PG: U41.2(GPB2) ; also sheet 1
3V3_CORE: C42.1 IC1.5(VCC) IC1.17(VCC) IC1.27(AVCC) IC1.29(AREF) IC1.38(VCC) R52.2 R55.2 R56.2 R59.2 U41.8(VDD) ; also sheet 1,2,3
3V3_CORE_ISO: R57.2 R61.2 ; also sheet 1,4
5V_AUX: R58.2 R60.2 ; also sheet 1,2,3,4,5
ADC_EXT_ALERT: R58.1 U41.22(GPA7) ; also sheet 5
ADC_OB_ALERT: R60.1 U41.4(GPB4) ; also sheet 5
ADC_SENSE_SW: IC1.40((PCINT8/XCK0/T0)PB0) ; also sheet 5
ALIVE_LED: IC1.23((PCINT20/TDO)PC4) ; also sheet 2
BMS_CTR: U41.16(GPA1) ; also sheet 1
BUS_LOGIC_EN_PRIME: U41.21(GPA6) ; also sheet 4
BUS_LOGIC_EN_SEC: U41.24(GPB0) ; also sheet 4
C0: IC1.21((PCINT18/TCK)PC2) ; also sheet 2
C1: IC1.22((PCINT19/TMS)PC3) ; also sheet 2
CS_EXT: IC1.37((PCINT0/ADC0)PA0) ; also sheet 4
DTR: C39.1 ; also sheet 2
EN_BUS_PRIME: IC1.26((PCINT23/TOSC2)PC7) ; also sheet 2
EN_BUS_SEC: IC1.25((PCINT22/TOSC1)PC6) ; also sheet 2
FAULT_PRIME: R57.1 U41.20(GPA5) ; also sheet 2
FAULT_SEC: R61.1 U41.6(GPB6) ; also sheet 2
FEATHER_CTS: IC1.31((PCINT6/ADC6)PA6) ; also sheet 3
FEATHER_EN: U41.7(GPB7) ; also sheet 1
FEATHER_GPIO: IC1.32((PCINT5/ADC5)PA5) ; also sheet 3
FEATHER_RTS: IC1.30((PCINT7/ADC7)PA7) ; also sheet 3
GLOBAL_INT: IC1.33((PCINT4/ADC4)PA4) U41.14(INTA)
GND: C40.1 C41.1 C42.2 IC1.6(GND) IC1.18(GND) IC1.28(GND) IC1.39(GND) IC1.TH(EXP) S4.1 S4.2 U41.11(ADDR) U41.23(VSS) U41.EP(VSS) ; also sheet 1,2,3,4,5
GPIO_0: IC1.13((PCINT28/OC1B)PD4) ; also sheet 4
GPIO_1: IC1.36((PCINT1/ADC1)PA1) ; also sheet 4
GPIO_2: IC1.43((PCINT11/OC0A/AIN1)PB3) ; also sheet 4
GPIO_3: IC1.35((PCINT2/ADC2)PA2) ; also sheet 4
LBI: U41.3(GPB3) ; also sheet 1
LED1: IC1.14((PCINT29/OC1A)PD5) ; also sheet 3
LED2: IC1.15((PCINT30/OC2B/ICP)PD6) ; also sheet 3
LED3: IC1.16((PCINT31/OC2A)PD7) ; also sheet 3
LOG_INT: IC1.34((PCINT3/ADC3)PA3) ; also sheet 3
MISO: IC1.2((PCINT14/MISO)PB6) ; also sheet 3,4
MOSI: IC1.1((PCINT13/MOSI)PB5) ; also sheet 3,4
MPPT_CHRG: R55.1 U41.18(GPA3) ; also sheet 1
MPPT_FAULT: R56.1 U41.19(GPA4) ; also sheet 1
N$17: R68.1 U41.15(GPA0)
N$61: C40.2 IC1.7(XTAL2) XTAL1.OSC2
N$62: C41.2 IC1.8(XTAL1) XTAL1.OSC1
PG_LDO: R59.1 U41.1(GPB1) ; also sheet 1
RST: C39.2 IC1.4(RESET) R52.1 S4.3 S4.4 U41.12(!RESET) ; also sheet 3
RTC_INT: IC1.42((PCINT10/INT2/AIN0)PB2) ; also sheet 5
RX: IC1.9((PCINT24/RXD0)PD0) ; also sheet 2,3
RX_EXT: IC1.11((PCINT26/INT0)PD2) ; also sheet 4
SCK: IC1.3((PCINT15/SCK)PB7) ; also sheet 3,4
SCL: IC1.19((PCINT16/SCL)PC0) U41.9(SCL) ; also sheet 3,4,5
SD_CD: IC1.41((PCINT9/CLKO/T1)PB1) ; also sheet 3
SD_CS: IC1.44((PCINT12/OC0B/!SS!)PB4) ; also sheet 4
SDA: IC1.20((PCINT17/SDA)PC1) ; also sheet 4
SDA_CTRL: IC1.24((PCINT21/TDI)PC5) ; also sheet 4
SDA_OB: U41.10(SDA) ; also sheet 3,4,5
TX: IC1.10((PCINT25/TXD0)PD1) ; also sheet 2,3
TX_EXT: IC1.12((PCINT27/INT1)PD3) ; also sheet 4
V_HP_SYNC: U41.5(GPB5) ; also sheet 1
VUSB_POWER: R68.2 ; also sheet 1,2
Unconnected: U41.13(INTB) U41.17(GPA2)

### Notes on the sheet
- Add:
  GPIO1
  GPIO3
- Pin A7/31
- Pin A6/30
- Pin A5/29
- Pin A4/28
- Pin A3/27
- Pin A2/26
- Pin A1/25
- Pin A0/24
- Pin 7
- Pin 6
- Pin 5
- ADD:
  --MPPT, CHRG (Input)
  --MPPT, FAULT (Input)
  --MPPT, SHDN (Output)
  --Feather PowerOn (Output)
  --ADC, OnBoard, Alert/RDY (Input, Interrupt)
  --ADC, OffBoard, Alert/RDY (Input, Interrupt)
  --Vusb (Input)
  --LevelShifter, Primary Bus, EN (Output)
  --LevelShifter, Secondary Bus, EN (Output)
  --BMS, CTR (Output)
  --BusPowerSwitch, Primary Bus, Fault (Input)
  --BusPowerSwitch, Secondary Bus, Fault (Input)
  --HighPowerBoost, LBO (Input, Interrupt?)
  --HighPowerBuck, PG (Input)
  --LowPowerLDO_3v3, PG (Input)
- Pin 4
- Pin 3
- Pin 2
- Pin 1
- Pin 0
- Pin 23
- Pin 22
- Pin 21
- Pin 20
- Pin 19
- Pin 18
- Pin 17
- Pin 16
- Pin 15
- Pin 14
- Pin 13
- Pin 12 | Also ext PWM
- Pin 11 | Ext Int1
- Pin 10 | Ext Int0
- Pin 9
- Pin 8

## Power pins joined to a net without a drawn wire
QOD: U21.5(QOD) U22.5(QOD)

## Library data of the parts
BT1 = bschulz:BATTERY_COIN: Coin Cell Battery Holder; DIGIKEY: BAT-HLD-012-SMT-ND; MF: Linx; MPN: BAT-HLD-012-SMT
C1 = bschulz_passives:C-EU: CAPACITOR, European symbol; DIGIKEY: 399-7415-1-ND; MF: Kemet; MPN: C0805C475K4RACTU
C2 C7-C10 C19 C20 = bschulz_passives:C-EU: CAPACITOR, European symbol; DIGIKEY: 490-9952-1-ND; MF: Murata; MPN: GRM219R61C226ME15L
C3 C4 C14 C22 C30 = bschulz_passives:C-EU: CAPACITOR, European symbol; DIGIKEY: 490-6473-6-ND; MF: Murata; MPN: GRM21BR61C106KE15K
C5 = bschulz_passives:CTANT_EU: Genaric Tantalum Capacitor; DIGIKEY: 478-5408-1-ND; MF: AVX; MPN: TPSY227K010R0100
C6 = bschulz_passives:C-EU: CAPACITOR, European symbol; DIGIKEY: 732-7474-1-ND; MF: Wurth; MPN: 885012005060
C11 C13 = bschulz_passives:C-EU: CAPACITOR, European symbol; DIGIKEY: 587-1251-1-ND; MF: Yaiyo Yuden; MPN: EMK107BJ105KA-T
C12 C17 C21 C25-C29 C31-C39 C44 C45 = bschulz_passives:C-EU: CAPACITOR, European symbol; DIGIKEY: 490-4759-1-ND; MF: Murata; MPN: GCM155R71C104KA55D
C15 C16 = bschulz_passives:C-EU: CAPACITOR, European symbol; DIGIKEY: 490-12265-1-ND; MF: Murata; MPN: GRT155R61E224KE01D
C18 = bschulz_passives:C-EU: CAPACITOR, European symbol; DIGIKEY: 490-10481-1-ND; MF: Murata; MPN: GRM188R61C475KAAJD
C23 C24 = bschulz_passives:C-EU: CAPACITOR, European symbol; DIGIKEY: 445-5585-1-ND; MF: TDK; MPN: CGA2B2C0G1H120J050BA
C40 C41 = bschulz_passives:C-EU: CAPACITOR, European symbol; DIGIKEY: 1276-1254-1-ND; MF: Samsung; MPN: CL10C120JB8NNNC
C42 = bschulz_passives:C-EU: CAPACITOR, European symbol; DIGIKEY: 1276-6524-1-ND; MF: Samsung; MPN: CL10B105MO8NNWC
C43 = bschulz_passives:CTANT_EU: Genaric Tantalum Capacitor; DIGIKEY: 718-1921-1-ND; MF: Vishay Sprague; MPN: TL8A0107M010D
D1 D3 = bschulz:DIODE: Genaric Diode; DIGIKEY: CMSH3-40MATR13CT-ND; MF: Central Semiconductor; MPN: CMSH3-40MA TR13
D2 = bschulz:DIODE: Genaric Diode; DIGIKEY: CMDSH2-3CT-ND; MF: Central Semiconductor; MPN: CMDSH2-3 TR
D4 D5 = bschulz:CLVBA-FKA: Cree RGB LED, Small Package, Common Anode, CLVBA-FKA Digikey: https://www.digikey.com/product-detail/en/cree-inc/CLVBA-FKA-CAEDH8BBB7A363/CLVBA-FKA-CAEDH8BBB7A363CT-ND/2650500; DIGIKEY: CLVBA-FKA-CAEDH8BBB7A363CT-ND; MF: Cree; MPN: CLVBA-FKA-CAEDH8BBB7A363
D6 D7 = bschulz:LM4040: LM4040 - Precision Micropower Shunt Voltage Referance Characteristics: VReverseBreakdown: 1.225V, 2.5V, 4.096V, 5.0V Output Current: 15 mA Tolerance: 1% Temp Coeficient: ±15ppm/C° Operating Temperature: -40°C to 85°C Digikey: 576-1047-1-ND (Microchip, 2.5V) <https://www.digikey.com/product-detail/en/microchip-technology/LM4040DYM3-2.5-TR/576-1047-1-ND/771818> 576-1048-1-ND (Microchip, 4.096V) <https://www.digikey.com/product-detail/en/microchip-technology/LM4040DYM3-4.1-TR/576-1048-1-ND/771819> 5LM4040CIM3-2.0/NOPBCT-ND (TI, 2.048V) <https://www.digikey.com/product-detail/en/texas-instruments/LM4040CIM3-2.0-NOPB/LM4040CIM3-2.0-NOPBCT-ND/2350623>; DIGIKEY: 576-1047-1-ND; MF: Microchip; MPN: LM4040DYM3-2.5-TR
D8 = bschulz:BAT54C: BAT54C; DIGIKEY: BAT54CLT1GOSCT-ND; MF: ON Semiconductor; MFP: BAT54CLT1G
D9 = bschulz:DIODE: Genaric Diode; DIGIKEY: B340A-FDICT-ND; MF: Diodes Incorporated; MPN: B340A-13-F
F1 = bschulz:PPTC: Resettable Fuse PPTC Resettable Fuse. Really a sort of resistor with a polymeric positive temperature coefficient whose resistance increases dramatically with an increase in temperature. When heated by the power passing through the resistance rises causing the current to be limited, protecting the circuit. This is achieved by the transition of the polymer from a crystalline to an amorphous state where the conductive carbon separates breaking the conductive pathways found in the cool crystalline structure. When a PPTC cools back down it resumes conducting letting the circuit turn back on. SparkFun Products: SparkFun RedBoard - Programmed with Arduino <https://www.sparkfun.com/products/12757> Pro Micro - 5V/16MHz <https://www.sparkfun.com/products/12640> Arduino Pro 328 - 5V/16MHz <https://www.sparkfun.com/products/10915> MP3 Trigger <https://www.sparkfun.com/products/13720>; DIGIKEY: MF-NSMF150-2CT-ND; MF: Bourns; MPN: MF-NSMF150-2
H1-H3 = bschulz:MOUNTING_HOLE: Genaric Mechanical Mounting Hole Hole diameter based on max body diameter + 15% Keepout ring is for diameter of socket cap screw (minimum required clearance) TPlace ring is for diameter of pan head screw (recomended clearance) Specifications: Socket Cap <http://fastener-express.com/fastener-technical/SocketscapSS-Alloy.pdf> Button Head Socket Cap <http://fastener-express.com/fastener-technical/Button-Socket-alloy.pdf> Pan Head <http://fastener-express.com/fastener-technical/pan-machine-Screws.pdf>
IC1 = bschulz:ATMEGA1284*: 8-bit Microcontroller with 128K Bytes In-System Programmable Flash Source: http://www.atmel.com/dyn/resources/prod_documents/doc2593.pdf; DIGIKEY: ATMEGA1284P-MURCT-ND; MF: Atmel; MPN: ATMEGA1284P-MUR
ISP1 = bschulz:AVRISP: AVR ISP HEADER Standard 6 pin header for AVR programming; DIGIKEY: 609-3234-ND; MF: Amphenol; MPN: 67997-206HLF
J1 J4 = bschulz:CONN_8: Genaric 8 terminal header Digikey 2.54_SCREW <https://www.digikey.com/product-detail/en/on-shore-technology-inc/OSTVN06A150/ED10565-ND/1588866>; DIGIKEY: ED10566-ND; MF: On Shore; MPN: OSTVN08A150
J2 = bschulz:CONN_10: Genaric 10 terminal header Digikey 2.54_SCREW <https://www.digikey.com/product-detail/en/on-shore-technology-inc/OSTVN10A150/ED10567-ND/1588870> 3.5_SCREW <https://www.digikey.com/product-detail/en/on-shore-technology-inc/OSTTE100104/ED2735-ND/2351811>; DIGIKEY: ED10567-ND; MF: On Shore; MPN: OSTVN10A150
J3 = bschulz:CONN_4: Genaric 4 terminal header Digikey 2.54_SCREW <https://www.digikey.com/product-detail/en/on-shore-technology-inc/OSTVN04A150/ED10563-ND/1588864>; DIGIKEY: ED10563-ND; MF: On Shore; MPN: OSTVN04A150
J5-J7 = bschulz:CONN_02: Genaric 2 terminal header SCREW_2.54 <https://www.digikey.com/product-detail/en/on-shore-technology-inc/OSTVN02A150/ED10561-ND/1588862>; DIGIKEY: ED10561-ND; MF: OnShore; MPN: OSTVN02A150
J8 = bschulz:JST_2MM_MALE: JST 2MM MALE RA CONNECTOR Two pin, compact surface mount connector. Commonly used as a battery input connection point. We really like the solid locking feeling and high current rating on these small connectors. We use these all the time as battery connectors. Mates to single-cell LiPo batteries. Here is the connector we sell at SparkFun: JST Right Angle Connector - White <https://www.sparkfun.com/products/8612> (PRT-08612) Datasheet <http://www.sparkfun.com/datasheets/Prototyping/Connectors/JST-Horizontal.pdf> It was used on these SparkFun products: SparkFun MOSFET Power Controller <https://www.sparkfun.com/products/11214> (PRT-11214) SparkFun Battery Babysitter - LiPo Battery Manager <https://www.sparkfun.com/products/13777> (PRT-13777) And many, many others that required a lipo battery connection.; DIGIKEY: 455-1749-1-ND; MF: JST; MPN: S2B-PH-SM4-TB(LF)(SN)
JP1-JP7 = SparkFun-Jumpers:JUMPER-SMT_2_NO: Normally open jumper This jumper has two pads in close proximity to each other. Apply solder to close the connection. Round pads are easier to solder for beginners, but are a lot larger. SparkFun Product that uses the round pads: SparkFun EL Sequencer <https://www.sparkfun.com/products/12781>
JP8 = SparkFun-Jumpers:JUMPER-SMT_3_1-NC_PASTE: Normally closed solder jumper (1 of 2 connections) This jumper has an aperture in the stencil to allow solder paste to bridge one of the two connections. One connection is normally closed (NC), while the other is normally open (NO). Wick off the solder to open the connection. Reapply solder to reclose the connection. Apply solder to the other side instead to change the current path.
L1 = bschulz:INDUCTOR: Genaric inductor; DIGIKEY: 732-4849-1-ND; MF: Wurth; MPN: 74438323068
L2 = bschulz:INDUCTOR: Genaric inductor; DIGIKEY: 732-10707-1-ND; MF: Wurth; MPN: 74439346100
L3 = bschulz:INDUCTOR: Genaric inductor; DIGIKEY: 732-5491-1-ND; MF: Wurth; MPN: 74404032010
L4 = bschulz:INDUCTOR: Genaric inductor; DIGIKEY: 732-11316-1-ND; MF: Wurth; MPN: 78438356047
MS1 = bschulz:FEATHERWING
Q1 Q2 Q6 = bschulz:MOSFET-NCH: N-channel MOSFETs Voltage controlled devices that allow control of high current outputs. SparkFun Products: SparkFun OpenScale <https://www.sparkfun.com/products/13261> SparkFun Digital Sandbox <https://www.sparkfun.com/products/12651> SparkFun Monster Moto Shield <https://www.sparkfun.com/products/10182> SparkFun MOSFET Power Controller <https://www.sparkfun.com/products/11214>; DIGIKEY: DMG3404L-7DICT-ND; MF: Diodes Incorporated; MPN: DMG3404L-7
Q3 Q5 = bschulz:MOSFET_PCH: P-channel MOSFETs Voltage controlled devices that allow control of high current outputs. SparkFun Products: SparkFun ESP32 Thing <https://www.sparkfun.com/products/13907> SparkFun ESP8266 Thing <https://www.sparkfun.com/products/13231>; DIGIKEY: FDN360PCT-ND; MF: Fairchild; MPN: FDN360P
Q4 Q7 Q8 = bschulz:MOSFET-NCH: N-channel MOSFETs Voltage controlled devices that allow control of high current outputs. SparkFun Products: SparkFun OpenScale <https://www.sparkfun.com/products/13261> SparkFun Digital Sandbox <https://www.sparkfun.com/products/12651> SparkFun Monster Moto Shield <https://www.sparkfun.com/products/10182> SparkFun MOSFET Power Controller <https://www.sparkfun.com/products/11214>; DIGIKEY: 2N7002W-FDICT-ND; MF: Diodes Incorporated; MPN: 2N7002W-7-F; PROD_ID: TRANS-11151
R1 R5 R7 R8 = bschulz_passives:R-EU_: RESISTOR, European symbol Digikey Parts: Yageo, 0402 <https://www.digikey.com/products/en/resistors/chip-resistor-surface-mount/52?k=&pkeyword=&sf=0&FV=ffec1104%2Cfffc000d%2C1c0002%2C440067%2C1f140000%2Cffe00034%2C400004&quantity=&ColumnSort=0&page=1&stock=1&pageSize=25> Yageo, 0603 <https://www.digikey.com/products/en/resistors/chip-resistor-surface-mount/52?k=&pkeyword=&s=4356&s=47360&sf=0&FV=fffc000d%2C1c0002%2C142c040c%2C1f140000%2Cffe00034&quantity=10&ColumnSort=1000011&page=1&stock=1&pageSize=25> Panasonic, 0603 <https://www.digikey.com/products/en/resistors/chip-resistor-surface-mount/52?k=&pkeyword=&pv252=68&sf=0&FV=ffec373d%2C1c0002%2C142c040c%2C1f140000%2Cffe00034%2C80002%2Cc0001&quantity=&ColumnSort=0&page=1&stock=1&pageSize=25> Panasonic, precision, 0603 <https://www.digikey.com/products/en/resistors/chip-resistor-surface-mount/52?FV=ffec4907%2Cfffc000a%2Cc0172%2C142c040c%2C1f140000%2Cffe00034%2C1c0002&quantity=100&ColumnSort=2085&page=1&stock=1&pageSize=25> Panasonic, 0805 <https://www.digikey.com/products/en/resistors/chip-resistor-surface-mount/52?k=&pkeyword=&pv3=1&sf=0&FV=ffec373d%2C1c0002%2C1f140000%2Cffe00034%2C142c040d&quantity=&ColumnSort=0&page=1&stock=1&pageSize=25> Rohm, current sense <https://www.digikey.com/products/en/resistors/chip-resistor-surface-mount/52?k=&pkeyword=&pv3=1&sf=0&FV=ffecb688%2C1f140000%2Cffe00034%2C1c0002&quantity=&ColumnSort=0&page=1&stock=1&pageSize=25> Vishay, pulse proof automotive <https://www.digikey.com/products/en/resistors/chip-resistor-surface-mount/52?k=&pkeyword=&pv7=2&sf=0&FV=ffec5d6b%2Cffe00034%2C1f140000&quantity=&ColumnSort=0&page=1&stock=1&pageSize=25>; DIGIKEY: P180KHCT-ND; MF: Panasonic; MPN: ERJ-3EKF1803V; VALUE_PART: 180k
R2 R4 = bschulz_passives:R-EU_: RESISTOR, European symbol Digikey Parts: Yageo, 0402 <https://www.digikey.com/products/en/resistors/chip-resistor-surface-mount/52?k=&pkeyword=&sf=0&FV=ffec1104%2Cfffc000d%2C1c0002%2C440067%2C1f140000%2Cffe00034%2C400004&quantity=&ColumnSort=0&page=1&stock=1&pageSize=25> Yageo, 0603 <https://www.digikey.com/products/en/resistors/chip-resistor-surface-mount/52?k=&pkeyword=&s=4356&s=47360&sf=0&FV=fffc000d%2C1c0002%2C142c040c%2C1f140000%2Cffe00034&quantity=10&ColumnSort=1000011&page=1&stock=1&pageSize=25> Panasonic, 0603 <https://www.digikey.com/products/en/resistors/chip-resistor-surface-mount/52?k=&pkeyword=&pv252=68&sf=0&FV=ffec373d%2C1c0002%2C142c040c%2C1f140000%2Cffe00034%2C80002%2Cc0001&quantity=&ColumnSort=0&page=1&stock=1&pageSize=25> Panasonic, precision, 0603 <https://www.digikey.com/products/en/resistors/chip-resistor-surface-mount/52?FV=ffec4907%2Cfffc000a%2Cc0172%2C142c040c%2C1f140000%2Cffe00034%2C1c0002&quantity=100&ColumnSort=2085&page=1&stock=1&pageSize=25> Panasonic, 0805 <https://www.digikey.com/products/en/resistors/chip-resistor-surface-mount/52?k=&pkeyword=&pv3=1&sf=0&FV=ffec373d%2C1c0002%2C1f140000%2Cffe00034%2C142c040d&quantity=&ColumnSort=0&page=1&stock=1&pageSize=25> Rohm, current sense <https://www.digikey.com/products/en/resistors/chip-resistor-surface-mount/52?k=&pkeyword=&pv3=1&sf=0&FV=ffecb688%2C1f140000%2Cffe00034%2C1c0002&quantity=&ColumnSort=0&page=1&stock=1&pageSize=25> Vishay, pulse proof automotive <https://www.digikey.com/products/en/resistors/chip-resistor-surface-mount/52?k=&pkeyword=&pv7=2&sf=0&FV=ffec5d6b%2Cffe00034%2C1f140000&quantity=&ColumnSort=0&page=1&stock=1&pageSize=25>; DIGIKEY: RMCF0603FT1M62CT-ND; MF: Stackpole; MPN: RMCF0603FT1M62; VALUE_PART: 1.62M
R3 = bschulz_passives:R-EU_: RESISTOR, European symbol Digikey Parts: Yageo, 0402 <https://www.digikey.com/products/en/resistors/chip-resistor-surface-mount/52?k=&pkeyword=&sf=0&FV=ffec1104%2Cfffc000d%2C1c0002%2C440067%2C1f140000%2Cffe00034%2C400004&quantity=&ColumnSort=0&page=1&stock=1&pageSize=25> Yageo, 0603 <https://www.digikey.com/products/en/resistors/chip-resistor-surface-mount/52?k=&pkeyword=&s=4356&s=47360&sf=0&FV=fffc000d%2C1c0002%2C142c040c%2C1f140000%2Cffe00034&quantity=10&ColumnSort=1000011&page=1&stock=1&pageSize=25> Panasonic, 0603 <https://www.digikey.com/products/en/resistors/chip-resistor-surface-mount/52?k=&pkeyword=&pv252=68&sf=0&FV=ffec373d%2C1c0002%2C142c040c%2C1f140000%2Cffe00034%2C80002%2Cc0001&quantity=&ColumnSort=0&page=1&stock=1&pageSize=25> Panasonic, precision, 0603 <https://www.digikey.com/products/en/resistors/chip-resistor-surface-mount/52?FV=ffec4907%2Cfffc000a%2Cc0172%2C142c040c%2C1f140000%2Cffe00034%2C1c0002&quantity=100&ColumnSort=2085&page=1&stock=1&pageSize=25> Panasonic, 0805 <https://www.digikey.com/products/en/resistors/chip-resistor-surface-mount/52?k=&pkeyword=&pv3=1&sf=0&FV=ffec373d%2C1c0002%2C1f140000%2Cffe00034%2C142c040d&quantity=&ColumnSort=0&page=1&stock=1&pageSize=25> Rohm, current sense <https://www.digikey.com/products/en/resistors/chip-resistor-surface-mount/52?k=&pkeyword=&pv3=1&sf=0&FV=ffecb688%2C1f140000%2Cffe00034%2C1c0002&quantity=&ColumnSort=0&page=1&stock=1&pageSize=25> Vishay, pulse proof automotive <https://www.digikey.com/products/en/resistors/chip-resistor-surface-mount/52?k=&pkeyword=&pv7=2&sf=0&FV=ffec5d6b%2Cffe00034%2C1f140000&quantity=&ColumnSort=0&page=1&stock=1&pageSize=25>; DIGIKEY: 311-360KHRCT-ND; MF: Yageo; MPN: RC0603FR-07360KL; VALUE_PART: 360k
R6 = bschulz_passives:R-EU_: RESISTOR, European symbol Digikey Parts: Yageo, 0402 <https://www.digikey.com/products/en/resistors/chip-resistor-surface-mount/52?k=&pkeyword=&sf=0&FV=ffec1104%2Cfffc000d%2C1c0002%2C440067%2C1f140000%2Cffe00034%2C400004&quantity=&ColumnSort=0&page=1&stock=1&pageSize=25> Yageo, 0603 <https://www.digikey.com/products/en/resistors/chip-resistor-surface-mount/52?k=&pkeyword=&s=4356&s=47360&sf=0&FV=fffc000d%2C1c0002%2C142c040c%2C1f140000%2Cffe00034&quantity=10&ColumnSort=1000011&page=1&stock=1&pageSize=25> Panasonic, 0603 <https://www.digikey.com/products/en/resistors/chip-resistor-surface-mount/52?k=&pkeyword=&pv252=68&sf=0&FV=ffec373d%2C1c0002%2C142c040c%2C1f140000%2Cffe00034%2C80002%2Cc0001&quantity=&ColumnSort=0&page=1&stock=1&pageSize=25> Panasonic, precision, 0603 <https://www.digikey.com/products/en/resistors/chip-resistor-surface-mount/52?FV=ffec4907%2Cfffc000a%2Cc0172%2C142c040c%2C1f140000%2Cffe00034%2C1c0002&quantity=100&ColumnSort=2085&page=1&stock=1&pageSize=25> Panasonic, 0805 <https://www.digikey.com/products/en/resistors/chip-resistor-surface-mount/52?k=&pkeyword=&pv3=1&sf=0&FV=ffec373d%2C1c0002%2C1f140000%2Cffe00034%2C142c040d&quantity=&ColumnSort=0&page=1&stock=1&pageSize=25> Rohm, current sense <https://www.digikey.com/products/en/resistors/chip-resistor-surface-mount/52?k=&pkeyword=&pv3=1&sf=0&FV=ffecb688%2C1f140000%2Cffe00034%2C1c0002&quantity=&ColumnSort=0&page=1&stock=1&pageSize=25> Vishay, pulse proof automotive <https://www.digikey.com/products/en/resistors/chip-resistor-surface-mount/52?k=&pkeyword=&pv7=2&sf=0&FV=ffec5d6b%2Cffe00034%2C1f140000&quantity=&ColumnSort=0&page=1&stock=1&pageSize=25>; DIGIKEY: 311-820KGRCT-ND; MF: Yageo; MPN: RC0603JR-07820KL; VALUE_PART: 820k
R9 = bschulz_passives:R-EU_: RESISTOR, European symbol Digikey Parts: Yageo, 0402 <https://www.digikey.com/products/en/resistors/chip-resistor-surface-mount/52?k=&pkeyword=&sf=0&FV=ffec1104%2Cfffc000d%2C1c0002%2C440067%2C1f140000%2Cffe00034%2C400004&quantity=&ColumnSort=0&page=1&stock=1&pageSize=25> Yageo, 0603 <https://www.digikey.com/products/en/resistors/chip-resistor-surface-mount/52?k=&pkeyword=&s=4356&s=47360&sf=0&FV=fffc000d%2C1c0002%2C142c040c%2C1f140000%2Cffe00034&quantity=10&ColumnSort=1000011&page=1&stock=1&pageSize=25> Panasonic, 0603 <https://www.digikey.com/products/en/resistors/chip-resistor-surface-mount/52?k=&pkeyword=&pv252=68&sf=0&FV=ffec373d%2C1c0002%2C142c040c%2C1f140000%2Cffe00034%2C80002%2Cc0001&quantity=&ColumnSort=0&page=1&stock=1&pageSize=25> Panasonic, precision, 0603 <https://www.digikey.com/products/en/resistors/chip-resistor-surface-mount/52?FV=ffec4907%2Cfffc000a%2Cc0172%2C142c040c%2C1f140000%2Cffe00034%2C1c0002&quantity=100&ColumnSort=2085&page=1&stock=1&pageSize=25> Panasonic, 0805 <https://www.digikey.com/products/en/resistors/chip-resistor-surface-mount/52?k=&pkeyword=&pv3=1&sf=0&FV=ffec373d%2C1c0002%2C1f140000%2Cffe00034%2C142c040d&quantity=&ColumnSort=0&page=1&stock=1&pageSize=25> Rohm, current sense <https://www.digikey.com/products/en/resistors/chip-resistor-surface-mount/52?k=&pkeyword=&pv3=1&sf=0&FV=ffecb688%2C1f140000%2Cffe00034%2C1c0002&quantity=&ColumnSort=0&page=1&stock=1&pageSize=25> Vishay, pulse proof automotive <https://www.digikey.com/products/en/resistors/chip-resistor-surface-mount/52?k=&pkeyword=&pv7=2&sf=0&FV=ffec5d6b%2Cffe00034%2C1f140000&quantity=&ColumnSort=0&page=1&stock=1&pageSize=25>; DIGIKEY: 311-330LRCT-ND; MF: Yageo; MPN: RC0402FR-07330RL; VALUE_PART: 330
R10 = bschulz_passives:R-EU_: RESISTOR, European symbol Digikey Parts: Yageo, 0402 <https://www.digikey.com/products/en/resistors/chip-resistor-surface-mount/52?k=&pkeyword=&sf=0&FV=ffec1104%2Cfffc000d%2C1c0002%2C440067%2C1f140000%2Cffe00034%2C400004&quantity=&ColumnSort=0&page=1&stock=1&pageSize=25> Yageo, 0603 <https://www.digikey.com/products/en/resistors/chip-resistor-surface-mount/52?k=&pkeyword=&s=4356&s=47360&sf=0&FV=fffc000d%2C1c0002%2C142c040c%2C1f140000%2Cffe00034&quantity=10&ColumnSort=1000011&page=1&stock=1&pageSize=25> Panasonic, 0603 <https://www.digikey.com/products/en/resistors/chip-resistor-surface-mount/52?k=&pkeyword=&pv252=68&sf=0&FV=ffec373d%2C1c0002%2C142c040c%2C1f140000%2Cffe00034%2C80002%2Cc0001&quantity=&ColumnSort=0&page=1&stock=1&pageSize=25> Panasonic, precision, 0603 <https://www.digikey.com/products/en/resistors/chip-resistor-surface-mount/52?FV=ffec4907%2Cfffc000a%2Cc0172%2C142c040c%2C1f140000%2Cffe00034%2C1c0002&quantity=100&ColumnSort=2085&page=1&stock=1&pageSize=25> Panasonic, 0805 <https://www.digikey.com/products/en/resistors/chip-resistor-surface-mount/52?k=&pkeyword=&pv3=1&sf=0&FV=ffec373d%2C1c0002%2C1f140000%2Cffe00034%2C142c040d&quantity=&ColumnSort=0&page=1&stock=1&pageSize=25> Rohm, current sense <https://www.digikey.com/products/en/resistors/chip-resistor-surface-mount/52?k=&pkeyword=&pv3=1&sf=0&FV=ffecb688%2C1f140000%2Cffe00034%2C1c0002&quantity=&ColumnSort=0&page=1&stock=1&pageSize=25> Vishay, pulse proof automotive <https://www.digikey.com/products/en/resistors/chip-resistor-surface-mount/52?k=&pkeyword=&pv7=2&sf=0&FV=ffec5d6b%2Cffe00034%2C1f140000&quantity=&ColumnSort=0&page=1&stock=1&pageSize=25>; DIGIKEY: RHM.003AJCT-ND; MF: Rohm; MPN: PMR10EZPFV3L00
R11 = bschulz_passives:R-EU_: RESISTOR, European symbol Digikey Parts: Yageo, 0402 <https://www.digikey.com/products/en/resistors/chip-resistor-surface-mount/52?k=&pkeyword=&sf=0&FV=ffec1104%2Cfffc000d%2C1c0002%2C440067%2C1f140000%2Cffe00034%2C400004&quantity=&ColumnSort=0&page=1&stock=1&pageSize=25> Yageo, 0603 <https://www.digikey.com/products/en/resistors/chip-resistor-surface-mount/52?k=&pkeyword=&s=4356&s=47360&sf=0&FV=fffc000d%2C1c0002%2C142c040c%2C1f140000%2Cffe00034&quantity=10&ColumnSort=1000011&page=1&stock=1&pageSize=25> Panasonic, 0603 <https://www.digikey.com/products/en/resistors/chip-resistor-surface-mount/52?k=&pkeyword=&pv252=68&sf=0&FV=ffec373d%2C1c0002%2C142c040c%2C1f140000%2Cffe00034%2C80002%2Cc0001&quantity=&ColumnSort=0&page=1&stock=1&pageSize=25> Panasonic, precision, 0603 <https://www.digikey.com/products/en/resistors/chip-resistor-surface-mount/52?FV=ffec4907%2Cfffc000a%2Cc0172%2C142c040c%2C1f140000%2Cffe00034%2C1c0002&quantity=100&ColumnSort=2085&page=1&stock=1&pageSize=25> Panasonic, 0805 <https://www.digikey.com/products/en/resistors/chip-resistor-surface-mount/52?k=&pkeyword=&pv3=1&sf=0&FV=ffec373d%2C1c0002%2C1f140000%2Cffe00034%2C142c040d&quantity=&ColumnSort=0&page=1&stock=1&pageSize=25> Rohm, current sense <https://www.digikey.com/products/en/resistors/chip-resistor-surface-mount/52?k=&pkeyword=&pv3=1&sf=0&FV=ffecb688%2C1f140000%2Cffe00034%2C1c0002&quantity=&ColumnSort=0&page=1&stock=1&pageSize=25> Vishay, pulse proof automotive <https://www.digikey.com/products/en/resistors/chip-resistor-surface-mount/52?k=&pkeyword=&pv7=2&sf=0&FV=ffec5d6b%2Cffe00034%2C1f140000&quantity=&ColumnSort=0&page=1&stock=1&pageSize=25>; DIGIKEY: 311-20LRCT-ND; MF: Yageo; MPN: RC0402FR-0720RL; VALUE_PART: 20
R12 = bschulz_passives:R-EU_: RESISTOR, European symbol Digikey Parts: Yageo, 0402 <https://www.digikey.com/products/en/resistors/chip-resistor-surface-mount/52?k=&pkeyword=&sf=0&FV=ffec1104%2Cfffc000d%2C1c0002%2C440067%2C1f140000%2Cffe00034%2C400004&quantity=&ColumnSort=0&page=1&stock=1&pageSize=25> Yageo, 0603 <https://www.digikey.com/products/en/resistors/chip-resistor-surface-mount/52?k=&pkeyword=&s=4356&s=47360&sf=0&FV=fffc000d%2C1c0002%2C142c040c%2C1f140000%2Cffe00034&quantity=10&ColumnSort=1000011&page=1&stock=1&pageSize=25> Panasonic, 0603 <https://www.digikey.com/products/en/resistors/chip-resistor-surface-mount/52?k=&pkeyword=&pv252=68&sf=0&FV=ffec373d%2C1c0002%2C142c040c%2C1f140000%2Cffe00034%2C80002%2Cc0001&quantity=&ColumnSort=0&page=1&stock=1&pageSize=25> Panasonic, precision, 0603 <https://www.digikey.com/products/en/resistors/chip-resistor-surface-mount/52?FV=ffec4907%2Cfffc000a%2Cc0172%2C142c040c%2C1f140000%2Cffe00034%2C1c0002&quantity=100&ColumnSort=2085&page=1&stock=1&pageSize=25> Panasonic, 0805 <https://www.digikey.com/products/en/resistors/chip-resistor-surface-mount/52?k=&pkeyword=&pv3=1&sf=0&FV=ffec373d%2C1c0002%2C1f140000%2Cffe00034%2C142c040d&quantity=&ColumnSort=0&page=1&stock=1&pageSize=25> Rohm, current sense <https://www.digikey.com/products/en/resistors/chip-resistor-surface-mount/52?k=&pkeyword=&pv3=1&sf=0&FV=ffecb688%2C1f140000%2Cffe00034%2C1c0002&quantity=&ColumnSort=0&page=1&stock=1&pageSize=25> Vishay, pulse proof automotive <https://www.digikey.com/products/en/resistors/chip-resistor-surface-mount/52?k=&pkeyword=&pv7=2&sf=0&FV=ffec5d6b%2Cffe00034%2C1f140000&quantity=&ColumnSort=0&page=1&stock=1&pageSize=25>; DIGIKEY: 311-1.00KLRCT-ND; MF: Yageo; MPN: RC0402FR-071KL; VALUE_PART: 1k
R13 = bschulz_passives:R-EU_: RESISTOR, European symbol Digikey Parts: Yageo, 0402 <https://www.digikey.com/products/en/resistors/chip-resistor-surface-mount/52?k=&pkeyword=&sf=0&FV=ffec1104%2Cfffc000d%2C1c0002%2C440067%2C1f140000%2Cffe00034%2C400004&quantity=&ColumnSort=0&page=1&stock=1&pageSize=25> Yageo, 0603 <https://www.digikey.com/products/en/resistors/chip-resistor-surface-mount/52?k=&pkeyword=&s=4356&s=47360&sf=0&FV=fffc000d%2C1c0002%2C142c040c%2C1f140000%2Cffe00034&quantity=10&ColumnSort=1000011&page=1&stock=1&pageSize=25> Panasonic, 0603 <https://www.digikey.com/products/en/resistors/chip-resistor-surface-mount/52?k=&pkeyword=&pv252=68&sf=0&FV=ffec373d%2C1c0002%2C142c040c%2C1f140000%2Cffe00034%2C80002%2Cc0001&quantity=&ColumnSort=0&page=1&stock=1&pageSize=25> Panasonic, precision, 0603 <https://www.digikey.com/products/en/resistors/chip-resistor-surface-mount/52?FV=ffec4907%2Cfffc000a%2Cc0172%2C142c040c%2C1f140000%2Cffe00034%2C1c0002&quantity=100&ColumnSort=2085&page=1&stock=1&pageSize=25> Panasonic, 0805 <https://www.digikey.com/products/en/resistors/chip-resistor-surface-mount/52?k=&pkeyword=&pv3=1&sf=0&FV=ffec373d%2C1c0002%2C1f140000%2Cffe00034%2C142c040d&quantity=&ColumnSort=0&page=1&stock=1&pageSize=25> Rohm, current sense <https://www.digikey.com/products/en/resistors/chip-resistor-surface-mount/52?k=&pkeyword=&pv3=1&sf=0&FV=ffecb688%2C1f140000%2Cffe00034%2C1c0002&quantity=&ColumnSort=0&page=1&stock=1&pageSize=25> Vishay, pulse proof automotive <https://www.digikey.com/products/en/resistors/chip-resistor-surface-mount/52?k=&pkeyword=&pv7=2&sf=0&FV=ffec5d6b%2Cffe00034%2C1f140000&quantity=&ColumnSort=0&page=1&stock=1&pageSize=25>; DIGIKEY: P182KHCT-ND; MF: Panasonic; MPN: ERJ-3EKF1823V; VALUE_PART: 182k
R14 = bschulz_passives:R-EU_: RESISTOR, European symbol Digikey Parts: Yageo, 0402 <https://www.digikey.com/products/en/resistors/chip-resistor-surface-mount/52?k=&pkeyword=&sf=0&FV=ffec1104%2Cfffc000d%2C1c0002%2C440067%2C1f140000%2Cffe00034%2C400004&quantity=&ColumnSort=0&page=1&stock=1&pageSize=25> Yageo, 0603 <https://www.digikey.com/products/en/resistors/chip-resistor-surface-mount/52?k=&pkeyword=&s=4356&s=47360&sf=0&FV=fffc000d%2C1c0002%2C142c040c%2C1f140000%2Cffe00034&quantity=10&ColumnSort=1000011&page=1&stock=1&pageSize=25> Panasonic, 0603 <https://www.digikey.com/products/en/resistors/chip-resistor-surface-mount/52?k=&pkeyword=&pv252=68&sf=0&FV=ffec373d%2C1c0002%2C142c040c%2C1f140000%2Cffe00034%2C80002%2Cc0001&quantity=&ColumnSort=0&page=1&stock=1&pageSize=25> Panasonic, precision, 0603 <https://www.digikey.com/products/en/resistors/chip-resistor-surface-mount/52?FV=ffec4907%2Cfffc000a%2Cc0172%2C142c040c%2C1f140000%2Cffe00034%2C1c0002&quantity=100&ColumnSort=2085&page=1&stock=1&pageSize=25> Panasonic, 0805 <https://www.digikey.com/products/en/resistors/chip-resistor-surface-mount/52?k=&pkeyword=&pv3=1&sf=0&FV=ffec373d%2C1c0002%2C1f140000%2Cffe00034%2C142c040d&quantity=&ColumnSort=0&page=1&stock=1&pageSize=25> Rohm, current sense <https://www.digikey.com/products/en/resistors/chip-resistor-surface-mount/52?k=&pkeyword=&pv3=1&sf=0&FV=ffecb688%2C1f140000%2Cffe00034%2C1c0002&quantity=&ColumnSort=0&page=1&stock=1&pageSize=25> Vishay, pulse proof automotive <https://www.digikey.com/products/en/resistors/chip-resistor-surface-mount/52?k=&pkeyword=&pv7=2&sf=0&FV=ffec5d6b%2Cffe00034%2C1f140000&quantity=&ColumnSort=0&page=1&stock=1&pageSize=25>; DIGIKEY: 311-100LRCT-ND; MF: Yageo; MPN: RC0402FR-07100RL; VALUE_PART: 100
R15 = bschulz_passives:R-EU_: RESISTOR, European symbol Digikey Parts: Yageo, 0402 <https://www.digikey.com/products/en/resistors/chip-resistor-surface-mount/52?k=&pkeyword=&sf=0&FV=ffec1104%2Cfffc000d%2C1c0002%2C440067%2C1f140000%2Cffe00034%2C400004&quantity=&ColumnSort=0&page=1&stock=1&pageSize=25> Yageo, 0603 <https://www.digikey.com/products/en/resistors/chip-resistor-surface-mount/52?k=&pkeyword=&s=4356&s=47360&sf=0&FV=fffc000d%2C1c0002%2C142c040c%2C1f140000%2Cffe00034&quantity=10&ColumnSort=1000011&page=1&stock=1&pageSize=25> Panasonic, 0603 <https://www.digikey.com/products/en/resistors/chip-resistor-surface-mount/52?k=&pkeyword=&pv252=68&sf=0&FV=ffec373d%2C1c0002%2C142c040c%2C1f140000%2Cffe00034%2C80002%2Cc0001&quantity=&ColumnSort=0&page=1&stock=1&pageSize=25> Panasonic, precision, 0603 <https://www.digikey.com/products/en/resistors/chip-resistor-surface-mount/52?FV=ffec4907%2Cfffc000a%2Cc0172%2C142c040c%2C1f140000%2Cffe00034%2C1c0002&quantity=100&ColumnSort=2085&page=1&stock=1&pageSize=25> Panasonic, 0805 <https://www.digikey.com/products/en/resistors/chip-resistor-surface-mount/52?k=&pkeyword=&pv3=1&sf=0&FV=ffec373d%2C1c0002%2C1f140000%2Cffe00034%2C142c040d&quantity=&ColumnSort=0&page=1&stock=1&pageSize=25> Rohm, current sense <https://www.digikey.com/products/en/resistors/chip-resistor-surface-mount/52?k=&pkeyword=&pv3=1&sf=0&FV=ffecb688%2C1f140000%2Cffe00034%2C1c0002&quantity=&ColumnSort=0&page=1&stock=1&pageSize=25> Vishay, pulse proof automotive <https://www.digikey.com/products/en/resistors/chip-resistor-surface-mount/52?k=&pkeyword=&pv7=2&sf=0&FV=ffec5d6b%2Cffe00034%2C1f140000&quantity=&ColumnSort=0&page=1&stock=1&pageSize=25>; DIGIKEY: 311-2KLRCT-ND; MF: Yageo; MPN: RC0402FR-072KL; VALUE_PART: 2k
R16 = bschulz_passives:R-EU_: RESISTOR, European symbol Digikey Parts: Yageo, 0402 <https://www.digikey.com/products/en/resistors/chip-resistor-surface-mount/52?k=&pkeyword=&sf=0&FV=ffec1104%2Cfffc000d%2C1c0002%2C440067%2C1f140000%2Cffe00034%2C400004&quantity=&ColumnSort=0&page=1&stock=1&pageSize=25> Yageo, 0603 <https://www.digikey.com/products/en/resistors/chip-resistor-surface-mount/52?k=&pkeyword=&s=4356&s=47360&sf=0&FV=fffc000d%2C1c0002%2C142c040c%2C1f140000%2Cffe00034&quantity=10&ColumnSort=1000011&page=1&stock=1&pageSize=25> Panasonic, 0603 <https://www.digikey.com/products/en/resistors/chip-resistor-surface-mount/52?k=&pkeyword=&pv252=68&sf=0&FV=ffec373d%2C1c0002%2C142c040c%2C1f140000%2Cffe00034%2C80002%2Cc0001&quantity=&ColumnSort=0&page=1&stock=1&pageSize=25> Panasonic, precision, 0603 <https://www.digikey.com/products/en/resistors/chip-resistor-surface-mount/52?FV=ffec4907%2Cfffc000a%2Cc0172%2C142c040c%2C1f140000%2Cffe00034%2C1c0002&quantity=100&ColumnSort=2085&page=1&stock=1&pageSize=25> Panasonic, 0805 <https://www.digikey.com/products/en/resistors/chip-resistor-surface-mount/52?k=&pkeyword=&pv3=1&sf=0&FV=ffec373d%2C1c0002%2C1f140000%2Cffe00034%2C142c040d&quantity=&ColumnSort=0&page=1&stock=1&pageSize=25> Rohm, current sense <https://www.digikey.com/products/en/resistors/chip-resistor-surface-mount/52?k=&pkeyword=&pv3=1&sf=0&FV=ffecb688%2C1f140000%2Cffe00034%2C1c0002&quantity=&ColumnSort=0&page=1&stock=1&pageSize=25> Vishay, pulse proof automotive <https://www.digikey.com/products/en/resistors/chip-resistor-surface-mount/52?k=&pkeyword=&pv7=2&sf=0&FV=ffec5d6b%2Cffe00034%2C1f140000&quantity=&ColumnSort=0&page=1&stock=1&pageSize=25>; DIGIKEY: P91.0KHCT-ND; MF: Panasonic; MPN: ERJ-3EKF9102V; VALUE_PART: 91k
R17 R62 = bschulz_passives:R-EU_: RESISTOR, European symbol Digikey Parts: Yageo, 0402 <https://www.digikey.com/products/en/resistors/chip-resistor-surface-mount/52?k=&pkeyword=&sf=0&FV=ffec1104%2Cfffc000d%2C1c0002%2C440067%2C1f140000%2Cffe00034%2C400004&quantity=&ColumnSort=0&page=1&stock=1&pageSize=25> Yageo, 0603 <https://www.digikey.com/products/en/resistors/chip-resistor-surface-mount/52?k=&pkeyword=&s=4356&s=47360&sf=0&FV=fffc000d%2C1c0002%2C142c040c%2C1f140000%2Cffe00034&quantity=10&ColumnSort=1000011&page=1&stock=1&pageSize=25> Panasonic, 0603 <https://www.digikey.com/products/en/resistors/chip-resistor-surface-mount/52?k=&pkeyword=&pv252=68&sf=0&FV=ffec373d%2C1c0002%2C142c040c%2C1f140000%2Cffe00034%2C80002%2Cc0001&quantity=&ColumnSort=0&page=1&stock=1&pageSize=25> Panasonic, precision, 0603 <https://www.digikey.com/products/en/resistors/chip-resistor-surface-mount/52?FV=ffec4907%2Cfffc000a%2Cc0172%2C142c040c%2C1f140000%2Cffe00034%2C1c0002&quantity=100&ColumnSort=2085&page=1&stock=1&pageSize=25> Panasonic, 0805 <https://www.digikey.com/products/en/resistors/chip-resistor-surface-mount/52?k=&pkeyword=&pv3=1&sf=0&FV=ffec373d%2C1c0002%2C1f140000%2Cffe00034%2C142c040d&quantity=&ColumnSort=0&page=1&stock=1&pageSize=25> Rohm, current sense <https://www.digikey.com/products/en/resistors/chip-resistor-surface-mount/52?k=&pkeyword=&pv3=1&sf=0&FV=ffecb688%2C1f140000%2Cffe00034%2C1c0002&quantity=&ColumnSort=0&page=1&stock=1&pageSize=25> Vishay, pulse proof automotive <https://www.digikey.com/products/en/resistors/chip-resistor-surface-mount/52?k=&pkeyword=&pv7=2&sf=0&FV=ffec5d6b%2Cffe00034%2C1f140000&quantity=&ColumnSort=0&page=1&stock=1&pageSize=25>; DIGIKEY: P330KHCT-ND; MF: Panasonic; MPN: ERJ-3EKF3303V; VALUE_PART: 330k
R18 = bschulz_passives:R-EU_: RESISTOR, European symbol Digikey Parts: Yageo, 0402 <https://www.digikey.com/products/en/resistors/chip-resistor-surface-mount/52?k=&pkeyword=&sf=0&FV=ffec1104%2Cfffc000d%2C1c0002%2C440067%2C1f140000%2Cffe00034%2C400004&quantity=&ColumnSort=0&page=1&stock=1&pageSize=25> Yageo, 0603 <https://www.digikey.com/products/en/resistors/chip-resistor-surface-mount/52?k=&pkeyword=&s=4356&s=47360&sf=0&FV=fffc000d%2C1c0002%2C142c040c%2C1f140000%2Cffe00034&quantity=10&ColumnSort=1000011&page=1&stock=1&pageSize=25> Panasonic, 0603 <https://www.digikey.com/products/en/resistors/chip-resistor-surface-mount/52?k=&pkeyword=&pv252=68&sf=0&FV=ffec373d%2C1c0002%2C142c040c%2C1f140000%2Cffe00034%2C80002%2Cc0001&quantity=&ColumnSort=0&page=1&stock=1&pageSize=25> Panasonic, precision, 0603 <https://www.digikey.com/products/en/resistors/chip-resistor-surface-mount/52?FV=ffec4907%2Cfffc000a%2Cc0172%2C142c040c%2C1f140000%2Cffe00034%2C1c0002&quantity=100&ColumnSort=2085&page=1&stock=1&pageSize=25> Panasonic, 0805 <https://www.digikey.com/products/en/resistors/chip-resistor-surface-mount/52?k=&pkeyword=&pv3=1&sf=0&FV=ffec373d%2C1c0002%2C1f140000%2Cffe00034%2C142c040d&quantity=&ColumnSort=0&page=1&stock=1&pageSize=25> Rohm, current sense <https://www.digikey.com/products/en/resistors/chip-resistor-surface-mount/52?k=&pkeyword=&pv3=1&sf=0&FV=ffecb688%2C1f140000%2Cffe00034%2C1c0002&quantity=&ColumnSort=0&page=1&stock=1&pageSize=25> Vishay, pulse proof automotive <https://www.digikey.com/products/en/resistors/chip-resistor-surface-mount/52?k=&pkeyword=&pv7=2&sf=0&FV=ffec5d6b%2Cffe00034%2C1f140000&quantity=&ColumnSort=0&page=1&stock=1&pageSize=25>; DIGIKEY: P50LLCT-ND; MF: Panasonic; MPN: ERJ-L06KF50MV
R19 = bschulz_passives:R-EU_: RESISTOR, European symbol Digikey Parts: Yageo, 0402 <https://www.digikey.com/products/en/resistors/chip-resistor-surface-mount/52?k=&pkeyword=&sf=0&FV=ffec1104%2Cfffc000d%2C1c0002%2C440067%2C1f140000%2Cffe00034%2C400004&quantity=&ColumnSort=0&page=1&stock=1&pageSize=25> Yageo, 0603 <https://www.digikey.com/products/en/resistors/chip-resistor-surface-mount/52?k=&pkeyword=&s=4356&s=47360&sf=0&FV=fffc000d%2C1c0002%2C142c040c%2C1f140000%2Cffe00034&quantity=10&ColumnSort=1000011&page=1&stock=1&pageSize=25> Panasonic, 0603 <https://www.digikey.com/products/en/resistors/chip-resistor-surface-mount/52?k=&pkeyword=&pv252=68&sf=0&FV=ffec373d%2C1c0002%2C142c040c%2C1f140000%2Cffe00034%2C80002%2Cc0001&quantity=&ColumnSort=0&page=1&stock=1&pageSize=25> Panasonic, precision, 0603 <https://www.digikey.com/products/en/resistors/chip-resistor-surface-mount/52?FV=ffec4907%2Cfffc000a%2Cc0172%2C142c040c%2C1f140000%2Cffe00034%2C1c0002&quantity=100&ColumnSort=2085&page=1&stock=1&pageSize=25> Panasonic, 0805 <https://www.digikey.com/products/en/resistors/chip-resistor-surface-mount/52?k=&pkeyword=&pv3=1&sf=0&FV=ffec373d%2C1c0002%2C1f140000%2Cffe00034%2C142c040d&quantity=&ColumnSort=0&page=1&stock=1&pageSize=25> Rohm, current sense <https://www.digikey.com/products/en/resistors/chip-resistor-surface-mount/52?k=&pkeyword=&pv3=1&sf=0&FV=ffecb688%2C1f140000%2Cffe00034%2C1c0002&quantity=&ColumnSort=0&page=1&stock=1&pageSize=25> Vishay, pulse proof automotive <https://www.digikey.com/products/en/resistors/chip-resistor-surface-mount/52?k=&pkeyword=&pv7=2&sf=0&FV=ffec5d6b%2Cffe00034%2C1f140000&quantity=&ColumnSort=0&page=1&stock=1&pageSize=25>; DIGIKEY: 311-120KLRCT-ND; MF: Yageo; MPN: RC0402FR-07120KL; VALUE_PART: 120k
R20 = bschulz_passives:R-EU_: RESISTOR, European symbol Digikey Parts: Yageo, 0402 <https://www.digikey.com/products/en/resistors/chip-resistor-surface-mount/52?k=&pkeyword=&sf=0&FV=ffec1104%2Cfffc000d%2C1c0002%2C440067%2C1f140000%2Cffe00034%2C400004&quantity=&ColumnSort=0&page=1&stock=1&pageSize=25> Yageo, 0603 <https://www.digikey.com/products/en/resistors/chip-resistor-surface-mount/52?k=&pkeyword=&s=4356&s=47360&sf=0&FV=fffc000d%2C1c0002%2C142c040c%2C1f140000%2Cffe00034&quantity=10&ColumnSort=1000011&page=1&stock=1&pageSize=25> Panasonic, 0603 <https://www.digikey.com/products/en/resistors/chip-resistor-surface-mount/52?k=&pkeyword=&pv252=68&sf=0&FV=ffec373d%2C1c0002%2C142c040c%2C1f140000%2Cffe00034%2C80002%2Cc0001&quantity=&ColumnSort=0&page=1&stock=1&pageSize=25> Panasonic, precision, 0603 <https://www.digikey.com/products/en/resistors/chip-resistor-surface-mount/52?FV=ffec4907%2Cfffc000a%2Cc0172%2C142c040c%2C1f140000%2Cffe00034%2C1c0002&quantity=100&ColumnSort=2085&page=1&stock=1&pageSize=25> Panasonic, 0805 <https://www.digikey.com/products/en/resistors/chip-resistor-surface-mount/52?k=&pkeyword=&pv3=1&sf=0&FV=ffec373d%2C1c0002%2C1f140000%2Cffe00034%2C142c040d&quantity=&ColumnSort=0&page=1&stock=1&pageSize=25> Rohm, current sense <https://www.digikey.com/products/en/resistors/chip-resistor-surface-mount/52?k=&pkeyword=&pv3=1&sf=0&FV=ffecb688%2C1f140000%2Cffe00034%2C1c0002&quantity=&ColumnSort=0&page=1&stock=1&pageSize=25> Vishay, pulse proof automotive <https://www.digikey.com/products/en/resistors/chip-resistor-surface-mount/52?k=&pkeyword=&pv7=2&sf=0&FV=ffec5d6b%2Cffe00034%2C1f140000&quantity=&ColumnSort=0&page=1&stock=1&pageSize=25>; DIGIKEY: 311-130KHRCT-ND; MF: Yageo; MPN: RC0603FR-07130KL; VALUE_PART: 130k
R21 = bschulz_passives:R-EU_: RESISTOR, European symbol Digikey Parts: Yageo, 0402 <https://www.digikey.com/products/en/resistors/chip-resistor-surface-mount/52?k=&pkeyword=&sf=0&FV=ffec1104%2Cfffc000d%2C1c0002%2C440067%2C1f140000%2Cffe00034%2C400004&quantity=&ColumnSort=0&page=1&stock=1&pageSize=25> Yageo, 0603 <https://www.digikey.com/products/en/resistors/chip-resistor-surface-mount/52?k=&pkeyword=&s=4356&s=47360&sf=0&FV=fffc000d%2C1c0002%2C142c040c%2C1f140000%2Cffe00034&quantity=10&ColumnSort=1000011&page=1&stock=1&pageSize=25> Panasonic, 0603 <https://www.digikey.com/products/en/resistors/chip-resistor-surface-mount/52?k=&pkeyword=&pv252=68&sf=0&FV=ffec373d%2C1c0002%2C142c040c%2C1f140000%2Cffe00034%2C80002%2Cc0001&quantity=&ColumnSort=0&page=1&stock=1&pageSize=25> Panasonic, precision, 0603 <https://www.digikey.com/products/en/resistors/chip-resistor-surface-mount/52?FV=ffec4907%2Cfffc000a%2Cc0172%2C142c040c%2C1f140000%2Cffe00034%2C1c0002&quantity=100&ColumnSort=2085&page=1&stock=1&pageSize=25> Panasonic, 0805 <https://www.digikey.com/products/en/resistors/chip-resistor-surface-mount/52?k=&pkeyword=&pv3=1&sf=0&FV=ffec373d%2C1c0002%2C1f140000%2Cffe00034%2C142c040d&quantity=&ColumnSort=0&page=1&stock=1&pageSize=25> Rohm, current sense <https://www.digikey.com/products/en/resistors/chip-resistor-surface-mount/52?k=&pkeyword=&pv3=1&sf=0&FV=ffecb688%2C1f140000%2Cffe00034%2C1c0002&quantity=&ColumnSort=0&page=1&stock=1&pageSize=25> Vishay, pulse proof automotive <https://www.digikey.com/products/en/resistors/chip-resistor-surface-mount/52?k=&pkeyword=&pv7=2&sf=0&FV=ffec5d6b%2Cffe00034%2C1f140000&quantity=&ColumnSort=0&page=1&stock=1&pageSize=25>; DIGIKEY: 311-470KGRCT-ND; MF: Yageo; MPN: RC0603JR-07470KL; VALUE_PART: 470k
R22 = bschulz_passives:R-EU_: RESISTOR, European symbol Digikey Parts: Yageo, 0402 <https://www.digikey.com/products/en/resistors/chip-resistor-surface-mount/52?k=&pkeyword=&sf=0&FV=ffec1104%2Cfffc000d%2C1c0002%2C440067%2C1f140000%2Cffe00034%2C400004&quantity=&ColumnSort=0&page=1&stock=1&pageSize=25> Yageo, 0603 <https://www.digikey.com/products/en/resistors/chip-resistor-surface-mount/52?k=&pkeyword=&s=4356&s=47360&sf=0&FV=fffc000d%2C1c0002%2C142c040c%2C1f140000%2Cffe00034&quantity=10&ColumnSort=1000011&page=1&stock=1&pageSize=25> Panasonic, 0603 <https://www.digikey.com/products/en/resistors/chip-resistor-surface-mount/52?k=&pkeyword=&pv252=68&sf=0&FV=ffec373d%2C1c0002%2C142c040c%2C1f140000%2Cffe00034%2C80002%2Cc0001&quantity=&ColumnSort=0&page=1&stock=1&pageSize=25> Panasonic, precision, 0603 <https://www.digikey.com/products/en/resistors/chip-resistor-surface-mount/52?FV=ffec4907%2Cfffc000a%2Cc0172%2C142c040c%2C1f140000%2Cffe00034%2C1c0002&quantity=100&ColumnSort=2085&page=1&stock=1&pageSize=25> Panasonic, 0805 <https://www.digikey.com/products/en/resistors/chip-resistor-surface-mount/52?k=&pkeyword=&pv3=1&sf=0&FV=ffec373d%2C1c0002%2C1f140000%2Cffe00034%2C142c040d&quantity=&ColumnSort=0&page=1&stock=1&pageSize=25> Rohm, current sense <https://www.digikey.com/products/en/resistors/chip-resistor-surface-mount/52?k=&pkeyword=&pv3=1&sf=0&FV=ffecb688%2C1f140000%2Cffe00034%2C1c0002&quantity=&ColumnSort=0&page=1&stock=1&pageSize=25> Vishay, pulse proof automotive <https://www.digikey.com/products/en/resistors/chip-resistor-surface-mount/52?k=&pkeyword=&pv7=2&sf=0&FV=ffec5d6b%2Cffe00034%2C1f140000&quantity=&ColumnSort=0&page=1&stock=1&pageSize=25>; DIGIKEY: 311-143KHRCT-ND; MF: Yageo; MPN: RC0603FR-07143KL; VALUE_PART: 143k
R23 R57 R58 R60 R61 R63 = bschulz_passives:R-EU_: RESISTOR, European symbol Digikey Parts: Yageo, 0402 <https://www.digikey.com/products/en/resistors/chip-resistor-surface-mount/52?k=&pkeyword=&sf=0&FV=ffec1104%2Cfffc000d%2C1c0002%2C440067%2C1f140000%2Cffe00034%2C400004&quantity=&ColumnSort=0&page=1&stock=1&pageSize=25> Yageo, 0603 <https://www.digikey.com/products/en/resistors/chip-resistor-surface-mount/52?k=&pkeyword=&s=4356&s=47360&sf=0&FV=fffc000d%2C1c0002%2C142c040c%2C1f140000%2Cffe00034&quantity=10&ColumnSort=1000011&page=1&stock=1&pageSize=25> Panasonic, 0603 <https://www.digikey.com/products/en/resistors/chip-resistor-surface-mount/52?k=&pkeyword=&pv252=68&sf=0&FV=ffec373d%2C1c0002%2C142c040c%2C1f140000%2Cffe00034%2C80002%2Cc0001&quantity=&ColumnSort=0&page=1&stock=1&pageSize=25> Panasonic, precision, 0603 <https://www.digikey.com/products/en/resistors/chip-resistor-surface-mount/52?FV=ffec4907%2Cfffc000a%2Cc0172%2C142c040c%2C1f140000%2Cffe00034%2C1c0002&quantity=100&ColumnSort=2085&page=1&stock=1&pageSize=25> Panasonic, 0805 <https://www.digikey.com/products/en/resistors/chip-resistor-surface-mount/52?k=&pkeyword=&pv3=1&sf=0&FV=ffec373d%2C1c0002%2C1f140000%2Cffe00034%2C142c040d&quantity=&ColumnSort=0&page=1&stock=1&pageSize=25> Rohm, current sense <https://www.digikey.com/products/en/resistors/chip-resistor-surface-mount/52?k=&pkeyword=&pv3=1&sf=0&FV=ffecb688%2C1f140000%2Cffe00034%2C1c0002&quantity=&ColumnSort=0&page=1&stock=1&pageSize=25> Vishay, pulse proof automotive <https://www.digikey.com/products/en/resistors/chip-resistor-surface-mount/52?k=&pkeyword=&pv7=2&sf=0&FV=ffec5d6b%2Cffe00034%2C1f140000&quantity=&ColumnSort=0&page=1&stock=1&pageSize=25>; DIGIKEY: 311-100KLRCT-ND; MF: Yageo; MPN: RC0402FR-07100KL; VALUE_PART: 100k
R24 R25 R41 R45-R47 R52 R54 R67 = bschulz_passives:R-EU_: RESISTOR, European symbol Digikey Parts: Yageo, 0402 <https://www.digikey.com/products/en/resistors/chip-resistor-surface-mount/52?k=&pkeyword=&sf=0&FV=ffec1104%2Cfffc000d%2C1c0002%2C440067%2C1f140000%2Cffe00034%2C400004&quantity=&ColumnSort=0&page=1&stock=1&pageSize=25> Yageo, 0603 <https://www.digikey.com/products/en/resistors/chip-resistor-surface-mount/52?k=&pkeyword=&s=4356&s=47360&sf=0&FV=fffc000d%2C1c0002%2C142c040c%2C1f140000%2Cffe00034&quantity=10&ColumnSort=1000011&page=1&stock=1&pageSize=25> Panasonic, 0603 <https://www.digikey.com/products/en/resistors/chip-resistor-surface-mount/52?k=&pkeyword=&pv252=68&sf=0&FV=ffec373d%2C1c0002%2C142c040c%2C1f140000%2Cffe00034%2C80002%2Cc0001&quantity=&ColumnSort=0&page=1&stock=1&pageSize=25> Panasonic, precision, 0603 <https://www.digikey.com/products/en/resistors/chip-resistor-surface-mount/52?FV=ffec4907%2Cfffc000a%2Cc0172%2C142c040c%2C1f140000%2Cffe00034%2C1c0002&quantity=100&ColumnSort=2085&page=1&stock=1&pageSize=25> Panasonic, 0805 <https://www.digikey.com/products/en/resistors/chip-resistor-surface-mount/52?k=&pkeyword=&pv3=1&sf=0&FV=ffec373d%2C1c0002%2C1f140000%2Cffe00034%2C142c040d&quantity=&ColumnSort=0&page=1&stock=1&pageSize=25> Rohm, current sense <https://www.digikey.com/products/en/resistors/chip-resistor-surface-mount/52?k=&pkeyword=&pv3=1&sf=0&FV=ffecb688%2C1f140000%2Cffe00034%2C1c0002&quantity=&ColumnSort=0&page=1&stock=1&pageSize=25> Vishay, pulse proof automotive <https://www.digikey.com/products/en/resistors/chip-resistor-surface-mount/52?k=&pkeyword=&pv7=2&sf=0&FV=ffec5d6b%2Cffe00034%2C1f140000&quantity=&ColumnSort=0&page=1&stock=1&pageSize=25>; DIGIKEY: 311-10.0KHRCT-ND; MF: Yageo; MPN: RC0603FR-0710KL; VALUE_PART: 10k
R26-R29 = bschulz_passives:R-EU_: RESISTOR, European symbol Digikey Parts: Yageo, 0402 <https://www.digikey.com/products/en/resistors/chip-resistor-surface-mount/52?k=&pkeyword=&sf=0&FV=ffec1104%2Cfffc000d%2C1c0002%2C440067%2C1f140000%2Cffe00034%2C400004&quantity=&ColumnSort=0&page=1&stock=1&pageSize=25> Yageo, 0603 <https://www.digikey.com/products/en/resistors/chip-resistor-surface-mount/52?k=&pkeyword=&s=4356&s=47360&sf=0&FV=fffc000d%2C1c0002%2C142c040c%2C1f140000%2Cffe00034&quantity=10&ColumnSort=1000011&page=1&stock=1&pageSize=25> Panasonic, 0603 <https://www.digikey.com/products/en/resistors/chip-resistor-surface-mount/52?k=&pkeyword=&pv252=68&sf=0&FV=ffec373d%2C1c0002%2C142c040c%2C1f140000%2Cffe00034%2C80002%2Cc0001&quantity=&ColumnSort=0&page=1&stock=1&pageSize=25> Panasonic, precision, 0603 <https://www.digikey.com/products/en/resistors/chip-resistor-surface-mount/52?FV=ffec4907%2Cfffc000a%2Cc0172%2C142c040c%2C1f140000%2Cffe00034%2C1c0002&quantity=100&ColumnSort=2085&page=1&stock=1&pageSize=25> Panasonic, 0805 <https://www.digikey.com/products/en/resistors/chip-resistor-surface-mount/52?k=&pkeyword=&pv3=1&sf=0&FV=ffec373d%2C1c0002%2C1f140000%2Cffe00034%2C142c040d&quantity=&ColumnSort=0&page=1&stock=1&pageSize=25> Rohm, current sense <https://www.digikey.com/products/en/resistors/chip-resistor-surface-mount/52?k=&pkeyword=&pv3=1&sf=0&FV=ffecb688%2C1f140000%2Cffe00034%2C1c0002&quantity=&ColumnSort=0&page=1&stock=1&pageSize=25> Vishay, pulse proof automotive <https://www.digikey.com/products/en/resistors/chip-resistor-surface-mount/52?k=&pkeyword=&pv7=2&sf=0&FV=ffec5d6b%2Cffe00034%2C1f140000&quantity=&ColumnSort=0&page=1&stock=1&pageSize=25>; DIGIKEY: YAG3063CT-ND; MF: Yageo; MPN: RC0402FR-07232RL; VALUE_PART: 232
R30-R33 = bschulz_passives:R-EU_: RESISTOR, European symbol Digikey Parts: Yageo, 0402 <https://www.digikey.com/products/en/resistors/chip-resistor-surface-mount/52?k=&pkeyword=&sf=0&FV=ffec1104%2Cfffc000d%2C1c0002%2C440067%2C1f140000%2Cffe00034%2C400004&quantity=&ColumnSort=0&page=1&stock=1&pageSize=25> Yageo, 0603 <https://www.digikey.com/products/en/resistors/chip-resistor-surface-mount/52?k=&pkeyword=&s=4356&s=47360&sf=0&FV=fffc000d%2C1c0002%2C142c040c%2C1f140000%2Cffe00034&quantity=10&ColumnSort=1000011&page=1&stock=1&pageSize=25> Panasonic, 0603 <https://www.digikey.com/products/en/resistors/chip-resistor-surface-mount/52?k=&pkeyword=&pv252=68&sf=0&FV=ffec373d%2C1c0002%2C142c040c%2C1f140000%2Cffe00034%2C80002%2Cc0001&quantity=&ColumnSort=0&page=1&stock=1&pageSize=25> Panasonic, precision, 0603 <https://www.digikey.com/products/en/resistors/chip-resistor-surface-mount/52?FV=ffec4907%2Cfffc000a%2Cc0172%2C142c040c%2C1f140000%2Cffe00034%2C1c0002&quantity=100&ColumnSort=2085&page=1&stock=1&pageSize=25> Panasonic, 0805 <https://www.digikey.com/products/en/resistors/chip-resistor-surface-mount/52?k=&pkeyword=&pv3=1&sf=0&FV=ffec373d%2C1c0002%2C1f140000%2Cffe00034%2C142c040d&quantity=&ColumnSort=0&page=1&stock=1&pageSize=25> Rohm, current sense <https://www.digikey.com/products/en/resistors/chip-resistor-surface-mount/52?k=&pkeyword=&pv3=1&sf=0&FV=ffecb688%2C1f140000%2Cffe00034%2C1c0002&quantity=&ColumnSort=0&page=1&stock=1&pageSize=25> Vishay, pulse proof automotive <https://www.digikey.com/products/en/resistors/chip-resistor-surface-mount/52?k=&pkeyword=&pv7=2&sf=0&FV=ffec5d6b%2Cffe00034%2C1f140000&quantity=&ColumnSort=0&page=1&stock=1&pageSize=25>; DIGIKEY: YAG3165CT-ND; MF: Yageo; MPN: RC0402FR-07453RL; VALUE_PART: 453
R34 R35 = bschulz_passives:R-EU_: RESISTOR, European symbol Digikey Parts: Yageo, 0402 <https://www.digikey.com/products/en/resistors/chip-resistor-surface-mount/52?k=&pkeyword=&sf=0&FV=ffec1104%2Cfffc000d%2C1c0002%2C440067%2C1f140000%2Cffe00034%2C400004&quantity=&ColumnSort=0&page=1&stock=1&pageSize=25> Yageo, 0603 <https://www.digikey.com/products/en/resistors/chip-resistor-surface-mount/52?k=&pkeyword=&s=4356&s=47360&sf=0&FV=fffc000d%2C1c0002%2C142c040c%2C1f140000%2Cffe00034&quantity=10&ColumnSort=1000011&page=1&stock=1&pageSize=25> Panasonic, 0603 <https://www.digikey.com/products/en/resistors/chip-resistor-surface-mount/52?k=&pkeyword=&pv252=68&sf=0&FV=ffec373d%2C1c0002%2C142c040c%2C1f140000%2Cffe00034%2C80002%2Cc0001&quantity=&ColumnSort=0&page=1&stock=1&pageSize=25> Panasonic, precision, 0603 <https://www.digikey.com/products/en/resistors/chip-resistor-surface-mount/52?FV=ffec4907%2Cfffc000a%2Cc0172%2C142c040c%2C1f140000%2Cffe00034%2C1c0002&quantity=100&ColumnSort=2085&page=1&stock=1&pageSize=25> Panasonic, 0805 <https://www.digikey.com/products/en/resistors/chip-resistor-surface-mount/52?k=&pkeyword=&pv3=1&sf=0&FV=ffec373d%2C1c0002%2C1f140000%2Cffe00034%2C142c040d&quantity=&ColumnSort=0&page=1&stock=1&pageSize=25> Rohm, current sense <https://www.digikey.com/products/en/resistors/chip-resistor-surface-mount/52?k=&pkeyword=&pv3=1&sf=0&FV=ffecb688%2C1f140000%2Cffe00034%2C1c0002&quantity=&ColumnSort=0&page=1&stock=1&pageSize=25> Vishay, pulse proof automotive <https://www.digikey.com/products/en/resistors/chip-resistor-surface-mount/52?k=&pkeyword=&pv7=2&sf=0&FV=ffec5d6b%2Cffe00034%2C1f140000&quantity=&ColumnSort=0&page=1&stock=1&pageSize=25>; DIGIKEY: YAG3086CT-ND; MF: Yageo; MPN: RC0402FR-0727RL; VALUE_PART: 27
R36 R38 R40 R42-R44 = bschulz_passives:R-EU_: RESISTOR, European symbol Digikey Parts: Yageo, 0402 <https://www.digikey.com/products/en/resistors/chip-resistor-surface-mount/52?k=&pkeyword=&sf=0&FV=ffec1104%2Cfffc000d%2C1c0002%2C440067%2C1f140000%2Cffe00034%2C400004&quantity=&ColumnSort=0&page=1&stock=1&pageSize=25> Yageo, 0603 <https://www.digikey.com/products/en/resistors/chip-resistor-surface-mount/52?k=&pkeyword=&s=4356&s=47360&sf=0&FV=fffc000d%2C1c0002%2C142c040c%2C1f140000%2Cffe00034&quantity=10&ColumnSort=1000011&page=1&stock=1&pageSize=25> Panasonic, 0603 <https://www.digikey.com/products/en/resistors/chip-resistor-surface-mount/52?k=&pkeyword=&pv252=68&sf=0&FV=ffec373d%2C1c0002%2C142c040c%2C1f140000%2Cffe00034%2C80002%2Cc0001&quantity=&ColumnSort=0&page=1&stock=1&pageSize=25> Panasonic, precision, 0603 <https://www.digikey.com/products/en/resistors/chip-resistor-surface-mount/52?FV=ffec4907%2Cfffc000a%2Cc0172%2C142c040c%2C1f140000%2Cffe00034%2C1c0002&quantity=100&ColumnSort=2085&page=1&stock=1&pageSize=25> Panasonic, 0805 <https://www.digikey.com/products/en/resistors/chip-resistor-surface-mount/52?k=&pkeyword=&pv3=1&sf=0&FV=ffec373d%2C1c0002%2C1f140000%2Cffe00034%2C142c040d&quantity=&ColumnSort=0&page=1&stock=1&pageSize=25> Rohm, current sense <https://www.digikey.com/products/en/resistors/chip-resistor-surface-mount/52?k=&pkeyword=&pv3=1&sf=0&FV=ffecb688%2C1f140000%2Cffe00034%2C1c0002&quantity=&ColumnSort=0&page=1&stock=1&pageSize=25> Vishay, pulse proof automotive <https://www.digikey.com/products/en/resistors/chip-resistor-surface-mount/52?k=&pkeyword=&pv7=2&sf=0&FV=ffec5d6b%2Cffe00034%2C1f140000&quantity=&ColumnSort=0&page=1&stock=1&pageSize=25>; DIGIKEY: 311-330LRCT-ND; MF: Yageo; MPN: RC0603FR-07330RL; VALUE_PART: 330
R37 R39 = bschulz_passives:R-EU_: RESISTOR, European symbol Digikey Parts: Yageo, 0402 <https://www.digikey.com/products/en/resistors/chip-resistor-surface-mount/52?k=&pkeyword=&sf=0&FV=ffec1104%2Cfffc000d%2C1c0002%2C440067%2C1f140000%2Cffe00034%2C400004&quantity=&ColumnSort=0&page=1&stock=1&pageSize=25> Yageo, 0603 <https://www.digikey.com/products/en/resistors/chip-resistor-surface-mount/52?k=&pkeyword=&s=4356&s=47360&sf=0&FV=fffc000d%2C1c0002%2C142c040c%2C1f140000%2Cffe00034&quantity=10&ColumnSort=1000011&page=1&stock=1&pageSize=25> Panasonic, 0603 <https://www.digikey.com/products/en/resistors/chip-resistor-surface-mount/52?k=&pkeyword=&pv252=68&sf=0&FV=ffec373d%2C1c0002%2C142c040c%2C1f140000%2Cffe00034%2C80002%2Cc0001&quantity=&ColumnSort=0&page=1&stock=1&pageSize=25> Panasonic, precision, 0603 <https://www.digikey.com/products/en/resistors/chip-resistor-surface-mount/52?FV=ffec4907%2Cfffc000a%2Cc0172%2C142c040c%2C1f140000%2Cffe00034%2C1c0002&quantity=100&ColumnSort=2085&page=1&stock=1&pageSize=25> Panasonic, 0805 <https://www.digikey.com/products/en/resistors/chip-resistor-surface-mount/52?k=&pkeyword=&pv3=1&sf=0&FV=ffec373d%2C1c0002%2C1f140000%2Cffe00034%2C142c040d&quantity=&ColumnSort=0&page=1&stock=1&pageSize=25> Rohm, current sense <https://www.digikey.com/products/en/resistors/chip-resistor-surface-mount/52?k=&pkeyword=&pv3=1&sf=0&FV=ffecb688%2C1f140000%2Cffe00034%2C1c0002&quantity=&ColumnSort=0&page=1&stock=1&pageSize=25> Vishay, pulse proof automotive <https://www.digikey.com/products/en/resistors/chip-resistor-surface-mount/52?k=&pkeyword=&pv7=2&sf=0&FV=ffec5d6b%2Cffe00034%2C1f140000&quantity=&ColumnSort=0&page=1&stock=1&pageSize=25>; DIGIKEY: 311-330HRCT-ND; MF: Yageo; MPN: RC0603FR-07330RL; VALUE_PART: 330
R48 = bschulz:R-EU_: RESISTOR, European symbol Digikey Parts: Yageo, 0402 <https://www.digikey.com/products/en/resistors/chip-resistor-surface-mount/52?k=&pkeyword=&sf=0&FV=ffec1104%2Cfffc000d%2C1c0002%2C440067%2C1f140000%2Cffe00034%2C400004&quantity=&ColumnSort=0&page=1&stock=1&pageSize=25> Yageo, 0603 <https://www.digikey.com/products/en/resistors/chip-resistor-surface-mount/52?k=&pkeyword=&s=4356&s=47360&sf=0&FV=fffc000d%2C1c0002%2C142c040c%2C1f140000%2Cffe00034&quantity=10&ColumnSort=1000011&page=1&stock=1&pageSize=25> Panasonic, 0603 <https://www.digikey.com/products/en/resistors/chip-resistor-surface-mount/52?k=&pkeyword=&pv252=68&sf=0&FV=ffec373d%2C1c0002%2C142c040c%2C1f140000%2Cffe00034%2C80002%2Cc0001&quantity=&ColumnSort=0&page=1&stock=1&pageSize=25> Panasonic, precision, 0603 <https://www.digikey.com/products/en/resistors/chip-resistor-surface-mount/52?FV=ffec4907%2Cfffc000a%2Cc0172%2C142c040c%2C1f140000%2Cffe00034%2C1c0002&quantity=100&ColumnSort=2085&page=1&stock=1&pageSize=25> Panasonic, 0805 <https://www.digikey.com/products/en/resistors/chip-resistor-surface-mount/52?k=&pkeyword=&pv3=1&sf=0&FV=ffec373d%2C1c0002%2C1f140000%2Cffe00034%2C142c040d&quantity=&ColumnSort=0&page=1&stock=1&pageSize=25> Rohm, current sense <https://www.digikey.com/products/en/resistors/chip-resistor-surface-mount/52?k=&pkeyword=&pv3=1&sf=0&FV=ffecb688%2C1f140000%2Cffe00034%2C1c0002&quantity=&ColumnSort=0&page=1&stock=1&pageSize=25> Vishay, pulse proof automotive <https://www.digikey.com/products/en/resistors/chip-resistor-surface-mount/52?k=&pkeyword=&pv7=2&sf=0&FV=ffec5d6b%2Cffe00034%2C1f140000&quantity=&ColumnSort=0&page=1&stock=1&pageSize=25>; DIGIKEY: 311-330HRCT-ND; MF: Yageo; MPN: RC0603FR-07330RL; VALUE_PART: 330
R49 R50 = bschulz_passives:R-EU_: RESISTOR, European symbol Digikey Parts: Yageo, 0402 <https://www.digikey.com/products/en/resistors/chip-resistor-surface-mount/52?k=&pkeyword=&sf=0&FV=ffec1104%2Cfffc000d%2C1c0002%2C440067%2C1f140000%2Cffe00034%2C400004&quantity=&ColumnSort=0&page=1&stock=1&pageSize=25> Yageo, 0603 <https://www.digikey.com/products/en/resistors/chip-resistor-surface-mount/52?k=&pkeyword=&s=4356&s=47360&sf=0&FV=fffc000d%2C1c0002%2C142c040c%2C1f140000%2Cffe00034&quantity=10&ColumnSort=1000011&page=1&stock=1&pageSize=25> Panasonic, 0603 <https://www.digikey.com/products/en/resistors/chip-resistor-surface-mount/52?k=&pkeyword=&pv252=68&sf=0&FV=ffec373d%2C1c0002%2C142c040c%2C1f140000%2Cffe00034%2C80002%2Cc0001&quantity=&ColumnSort=0&page=1&stock=1&pageSize=25> Panasonic, precision, 0603 <https://www.digikey.com/products/en/resistors/chip-resistor-surface-mount/52?FV=ffec4907%2Cfffc000a%2Cc0172%2C142c040c%2C1f140000%2Cffe00034%2C1c0002&quantity=100&ColumnSort=2085&page=1&stock=1&pageSize=25> Panasonic, 0805 <https://www.digikey.com/products/en/resistors/chip-resistor-surface-mount/52?k=&pkeyword=&pv3=1&sf=0&FV=ffec373d%2C1c0002%2C1f140000%2Cffe00034%2C142c040d&quantity=&ColumnSort=0&page=1&stock=1&pageSize=25> Rohm, current sense <https://www.digikey.com/products/en/resistors/chip-resistor-surface-mount/52?k=&pkeyword=&pv3=1&sf=0&FV=ffecb688%2C1f140000%2Cffe00034%2C1c0002&quantity=&ColumnSort=0&page=1&stock=1&pageSize=25> Vishay, pulse proof automotive <https://www.digikey.com/products/en/resistors/chip-resistor-surface-mount/52?k=&pkeyword=&pv7=2&sf=0&FV=ffec5d6b%2Cffe00034%2C1f140000&quantity=&ColumnSort=0&page=1&stock=1&pageSize=25>; DIGIKEY: P10KDBCT-ND; MF: Panasonic; MPN: ERA-3AEB103V; VALUE_PART: 10k
R51 = bschulz_passives:R-EU_: RESISTOR, European symbol Digikey Parts: Yageo, 0402 <https://www.digikey.com/products/en/resistors/chip-resistor-surface-mount/52?k=&pkeyword=&sf=0&FV=ffec1104%2Cfffc000d%2C1c0002%2C440067%2C1f140000%2Cffe00034%2C400004&quantity=&ColumnSort=0&page=1&stock=1&pageSize=25> Yageo, 0603 <https://www.digikey.com/products/en/resistors/chip-resistor-surface-mount/52?k=&pkeyword=&s=4356&s=47360&sf=0&FV=fffc000d%2C1c0002%2C142c040c%2C1f140000%2Cffe00034&quantity=10&ColumnSort=1000011&page=1&stock=1&pageSize=25> Panasonic, 0603 <https://www.digikey.com/products/en/resistors/chip-resistor-surface-mount/52?k=&pkeyword=&pv252=68&sf=0&FV=ffec373d%2C1c0002%2C142c040c%2C1f140000%2Cffe00034%2C80002%2Cc0001&quantity=&ColumnSort=0&page=1&stock=1&pageSize=25> Panasonic, precision, 0603 <https://www.digikey.com/products/en/resistors/chip-resistor-surface-mount/52?FV=ffec4907%2Cfffc000a%2Cc0172%2C142c040c%2C1f140000%2Cffe00034%2C1c0002&quantity=100&ColumnSort=2085&page=1&stock=1&pageSize=25> Panasonic, 0805 <https://www.digikey.com/products/en/resistors/chip-resistor-surface-mount/52?k=&pkeyword=&pv3=1&sf=0&FV=ffec373d%2C1c0002%2C1f140000%2Cffe00034%2C142c040d&quantity=&ColumnSort=0&page=1&stock=1&pageSize=25> Rohm, current sense <https://www.digikey.com/products/en/resistors/chip-resistor-surface-mount/52?k=&pkeyword=&pv3=1&sf=0&FV=ffecb688%2C1f140000%2Cffe00034%2C1c0002&quantity=&ColumnSort=0&page=1&stock=1&pageSize=25> Vishay, pulse proof automotive <https://www.digikey.com/products/en/resistors/chip-resistor-surface-mount/52?k=&pkeyword=&pv7=2&sf=0&FV=ffec5d6b%2Cffe00034%2C1f140000&quantity=&ColumnSort=0&page=1&stock=1&pageSize=25>; DIGIKEY: 311-20.0KHRCT-ND; MF: Yageo; MPN: RC0603FR-0720KL; VALUE_PART: 20k
R53 R55 R56 R59 R64 R68 = bschulz_passives:R-EU_: RESISTOR, European symbol Digikey Parts: Yageo, 0402 <https://www.digikey.com/products/en/resistors/chip-resistor-surface-mount/52?k=&pkeyword=&sf=0&FV=ffec1104%2Cfffc000d%2C1c0002%2C440067%2C1f140000%2Cffe00034%2C400004&quantity=&ColumnSort=0&page=1&stock=1&pageSize=25> Yageo, 0603 <https://www.digikey.com/products/en/resistors/chip-resistor-surface-mount/52?k=&pkeyword=&s=4356&s=47360&sf=0&FV=fffc000d%2C1c0002%2C142c040c%2C1f140000%2Cffe00034&quantity=10&ColumnSort=1000011&page=1&stock=1&pageSize=25> Panasonic, 0603 <https://www.digikey.com/products/en/resistors/chip-resistor-surface-mount/52?k=&pkeyword=&pv252=68&sf=0&FV=ffec373d%2C1c0002%2C142c040c%2C1f140000%2Cffe00034%2C80002%2Cc0001&quantity=&ColumnSort=0&page=1&stock=1&pageSize=25> Panasonic, precision, 0603 <https://www.digikey.com/products/en/resistors/chip-resistor-surface-mount/52?FV=ffec4907%2Cfffc000a%2Cc0172%2C142c040c%2C1f140000%2Cffe00034%2C1c0002&quantity=100&ColumnSort=2085&page=1&stock=1&pageSize=25> Panasonic, 0805 <https://www.digikey.com/products/en/resistors/chip-resistor-surface-mount/52?k=&pkeyword=&pv3=1&sf=0&FV=ffec373d%2C1c0002%2C1f140000%2Cffe00034%2C142c040d&quantity=&ColumnSort=0&page=1&stock=1&pageSize=25> Rohm, current sense <https://www.digikey.com/products/en/resistors/chip-resistor-surface-mount/52?k=&pkeyword=&pv3=1&sf=0&FV=ffecb688%2C1f140000%2Cffe00034%2C1c0002&quantity=&ColumnSort=0&page=1&stock=1&pageSize=25> Vishay, pulse proof automotive <https://www.digikey.com/products/en/resistors/chip-resistor-surface-mount/52?k=&pkeyword=&pv7=2&sf=0&FV=ffec5d6b%2Cffe00034%2C1f140000&quantity=&ColumnSort=0&page=1&stock=1&pageSize=25>; DIGIKEY: 311-1.00MLRCT-ND; MF: Yageo; MPN: RC0402FR-071ML; VALUE_PART: 1M
R65 R66 = bschulz_passives:R-EU_: RESISTOR, European symbol Digikey Parts: Yageo, 0402 <https://www.digikey.com/products/en/resistors/chip-resistor-surface-mount/52?k=&pkeyword=&sf=0&FV=ffec1104%2Cfffc000d%2C1c0002%2C440067%2C1f140000%2Cffe00034%2C400004&quantity=&ColumnSort=0&page=1&stock=1&pageSize=25> Yageo, 0603 <https://www.digikey.com/products/en/resistors/chip-resistor-surface-mount/52?k=&pkeyword=&s=4356&s=47360&sf=0&FV=fffc000d%2C1c0002%2C142c040c%2C1f140000%2Cffe00034&quantity=10&ColumnSort=1000011&page=1&stock=1&pageSize=25> Panasonic, 0603 <https://www.digikey.com/products/en/resistors/chip-resistor-surface-mount/52?k=&pkeyword=&pv252=68&sf=0&FV=ffec373d%2C1c0002%2C142c040c%2C1f140000%2Cffe00034%2C80002%2Cc0001&quantity=&ColumnSort=0&page=1&stock=1&pageSize=25> Panasonic, precision, 0603 <https://www.digikey.com/products/en/resistors/chip-resistor-surface-mount/52?FV=ffec4907%2Cfffc000a%2Cc0172%2C142c040c%2C1f140000%2Cffe00034%2C1c0002&quantity=100&ColumnSort=2085&page=1&stock=1&pageSize=25> Panasonic, 0805 <https://www.digikey.com/products/en/resistors/chip-resistor-surface-mount/52?k=&pkeyword=&pv3=1&sf=0&FV=ffec373d%2C1c0002%2C1f140000%2Cffe00034%2C142c040d&quantity=&ColumnSort=0&page=1&stock=1&pageSize=25> Rohm, current sense <https://www.digikey.com/products/en/resistors/chip-resistor-surface-mount/52?k=&pkeyword=&pv3=1&sf=0&FV=ffecb688%2C1f140000%2Cffe00034%2C1c0002&quantity=&ColumnSort=0&page=1&stock=1&pageSize=25> Vishay, pulse proof automotive <https://www.digikey.com/products/en/resistors/chip-resistor-surface-mount/52?k=&pkeyword=&pv7=2&sf=0&FV=ffec5d6b%2Cffe00034%2C1f140000&quantity=&ColumnSort=0&page=1&stock=1&pageSize=25>; DIGIKEY: 311-180KLRCT-ND; MF: Yageo; MPN: RC0402FR-07180KL; VALUE_PART: 180k
R69 = bschulz_passives:R-EU_: RESISTOR, European symbol Digikey Parts: Yageo, 0402 <https://www.digikey.com/products/en/resistors/chip-resistor-surface-mount/52?k=&pkeyword=&sf=0&FV=ffec1104%2Cfffc000d%2C1c0002%2C440067%2C1f140000%2Cffe00034%2C400004&quantity=&ColumnSort=0&page=1&stock=1&pageSize=25> Yageo, 0603 <https://www.digikey.com/products/en/resistors/chip-resistor-surface-mount/52?k=&pkeyword=&s=4356&s=47360&sf=0&FV=fffc000d%2C1c0002%2C142c040c%2C1f140000%2Cffe00034&quantity=10&ColumnSort=1000011&page=1&stock=1&pageSize=25> Panasonic, 0603 <https://www.digikey.com/products/en/resistors/chip-resistor-surface-mount/52?k=&pkeyword=&pv252=68&sf=0&FV=ffec373d%2C1c0002%2C142c040c%2C1f140000%2Cffe00034%2C80002%2Cc0001&quantity=&ColumnSort=0&page=1&stock=1&pageSize=25> Panasonic, precision, 0603 <https://www.digikey.com/products/en/resistors/chip-resistor-surface-mount/52?FV=ffec4907%2Cfffc000a%2Cc0172%2C142c040c%2C1f140000%2Cffe00034%2C1c0002&quantity=100&ColumnSort=2085&page=1&stock=1&pageSize=25> Panasonic, 0805 <https://www.digikey.com/products/en/resistors/chip-resistor-surface-mount/52?k=&pkeyword=&pv3=1&sf=0&FV=ffec373d%2C1c0002%2C1f140000%2Cffe00034%2C142c040d&quantity=&ColumnSort=0&page=1&stock=1&pageSize=25> Rohm, current sense <https://www.digikey.com/products/en/resistors/chip-resistor-surface-mount/52?k=&pkeyword=&pv3=1&sf=0&FV=ffecb688%2C1f140000%2Cffe00034%2C1c0002&quantity=&ColumnSort=0&page=1&stock=1&pageSize=25> Vishay, pulse proof automotive <https://www.digikey.com/products/en/resistors/chip-resistor-surface-mount/52?k=&pkeyword=&pv7=2&sf=0&FV=ffec5d6b%2Cffe00034%2C1f140000&quantity=&ColumnSort=0&page=1&stock=1&pageSize=25>; DIGIKEY: RC0402FR-071ML; MF: Yageo; MPN: RC0603FR-07100KL; VALUE_PART: 100k
R70 = bschulz_passives:R-EU_: RESISTOR, European symbol Digikey Parts: Yageo, 0402 <https://www.digikey.com/products/en/resistors/chip-resistor-surface-mount/52?k=&pkeyword=&sf=0&FV=ffec1104%2Cfffc000d%2C1c0002%2C440067%2C1f140000%2Cffe00034%2C400004&quantity=&ColumnSort=0&page=1&stock=1&pageSize=25> Yageo, 0603 <https://www.digikey.com/products/en/resistors/chip-resistor-surface-mount/52?k=&pkeyword=&s=4356&s=47360&sf=0&FV=fffc000d%2C1c0002%2C142c040c%2C1f140000%2Cffe00034&quantity=10&ColumnSort=1000011&page=1&stock=1&pageSize=25> Panasonic, 0603 <https://www.digikey.com/products/en/resistors/chip-resistor-surface-mount/52?k=&pkeyword=&pv252=68&sf=0&FV=ffec373d%2C1c0002%2C142c040c%2C1f140000%2Cffe00034%2C80002%2Cc0001&quantity=&ColumnSort=0&page=1&stock=1&pageSize=25> Panasonic, precision, 0603 <https://www.digikey.com/products/en/resistors/chip-resistor-surface-mount/52?FV=ffec4907%2Cfffc000a%2Cc0172%2C142c040c%2C1f140000%2Cffe00034%2C1c0002&quantity=100&ColumnSort=2085&page=1&stock=1&pageSize=25> Panasonic, 0805 <https://www.digikey.com/products/en/resistors/chip-resistor-surface-mount/52?k=&pkeyword=&pv3=1&sf=0&FV=ffec373d%2C1c0002%2C1f140000%2Cffe00034%2C142c040d&quantity=&ColumnSort=0&page=1&stock=1&pageSize=25> Rohm, current sense <https://www.digikey.com/products/en/resistors/chip-resistor-surface-mount/52?k=&pkeyword=&pv3=1&sf=0&FV=ffecb688%2C1f140000%2Cffe00034%2C1c0002&quantity=&ColumnSort=0&page=1&stock=1&pageSize=25> Vishay, pulse proof automotive <https://www.digikey.com/products/en/resistors/chip-resistor-surface-mount/52?k=&pkeyword=&pv7=2&sf=0&FV=ffec5d6b%2Cffe00034%2C1f140000&quantity=&ColumnSort=0&page=1&stock=1&pageSize=25>; DIGIKEY: 311-200KHRCT-ND; MF: Yageo; MPN: RC0603FR-07200KL; VALUE_PART: 200k
R71 = bschulz_passives:R-EU_: RESISTOR, European symbol Digikey Parts: Yageo, 0402 <https://www.digikey.com/products/en/resistors/chip-resistor-surface-mount/52?k=&pkeyword=&sf=0&FV=ffec1104%2Cfffc000d%2C1c0002%2C440067%2C1f140000%2Cffe00034%2C400004&quantity=&ColumnSort=0&page=1&stock=1&pageSize=25> Yageo, 0603 <https://www.digikey.com/products/en/resistors/chip-resistor-surface-mount/52?k=&pkeyword=&s=4356&s=47360&sf=0&FV=fffc000d%2C1c0002%2C142c040c%2C1f140000%2Cffe00034&quantity=10&ColumnSort=1000011&page=1&stock=1&pageSize=25> Panasonic, 0603 <https://www.digikey.com/products/en/resistors/chip-resistor-surface-mount/52?k=&pkeyword=&pv252=68&sf=0&FV=ffec373d%2C1c0002%2C142c040c%2C1f140000%2Cffe00034%2C80002%2Cc0001&quantity=&ColumnSort=0&page=1&stock=1&pageSize=25> Panasonic, precision, 0603 <https://www.digikey.com/products/en/resistors/chip-resistor-surface-mount/52?FV=ffec4907%2Cfffc000a%2Cc0172%2C142c040c%2C1f140000%2Cffe00034%2C1c0002&quantity=100&ColumnSort=2085&page=1&stock=1&pageSize=25> Panasonic, 0805 <https://www.digikey.com/products/en/resistors/chip-resistor-surface-mount/52?k=&pkeyword=&pv3=1&sf=0&FV=ffec373d%2C1c0002%2C1f140000%2Cffe00034%2C142c040d&quantity=&ColumnSort=0&page=1&stock=1&pageSize=25> Rohm, current sense <https://www.digikey.com/products/en/resistors/chip-resistor-surface-mount/52?k=&pkeyword=&pv3=1&sf=0&FV=ffecb688%2C1f140000%2Cffe00034%2C1c0002&quantity=&ColumnSort=0&page=1&stock=1&pageSize=25> Vishay, pulse proof automotive <https://www.digikey.com/products/en/resistors/chip-resistor-surface-mount/52?k=&pkeyword=&pv7=2&sf=0&FV=ffec5d6b%2Cffe00034%2C1f140000&quantity=&ColumnSort=0&page=1&stock=1&pageSize=25>; DIGIKEY: P1.00MHCT-ND; MF: Panasonic; MPN: ERJ-3EKF1004V; VALUE_PART: 1M
RTC1 = bschulz:DS3231M: DS3231M Real Time Clock Accuracy +/-5ppm. Battery Backup. 2.3V to 5.5V. Datasheet <https://cdn.sparkfun.com/datasheets/Dev/Beagle/DS3231M.pdf> SparkFun Products CryptoCape <https://www.sparkfun.com/products/12773> (DEV-12773) SparkFun CryptoShield <https://www.sparkfun.com/products/13183> (DEV-13183); DIGIKEY: DS3231MZ+-ND; MF: Maxim; MPN: DS3231MZ+
S1 S2 = bschulz:SPDT: Genaric SPDT switch; DIGIKEY: 401-2016-1-ND; MF: C&K; MPN: PCM12SMTR
S3 S4 = bschulz:BUTTON: Genaric SPST Pushbutton; DIGIKEY: CKN10504CT-ND; MF: C&K; MPN: PTS810 SJG 250 SMTR LFS
S5 = bschulz:BUTTON: Genaric SPST Pushbutton; DIGIKEY: P19888CT-ND; MF: Panasonic; MPN: EVP-BB2A9B000
SD1 = bschulz:MICROSD: Micro-SD / Transflash card holder with SPI pinout For the 3M # 2908-05WB-MG and/or 4UCON #19656 push-push type; DIGIKEY: WM19093CT-ND; MF: Molex; MPN: 5025700893
U1 = bschulz:TLV61220: TLV61220 - Low-Input Voltage Step-Up Converter (Boost) Characteristics: Vin: 0.7V ~ 5.5V Vout: 1.8V ~ 5.5V Output Current (Max): 400 mA IQ: 5μA Operating Temperature: -40°C to 85°C Digikey: 296-30547-1-ND <https://www.digikey.com/product-detail/en/texas-instruments/TLV61220DBVR/296-30547-1-ND/3458120>; DIGIKEY: 296-30547-1-ND; MF: TI; MPN: TLV61220DBVR
U2 = bschulz:TPS6282*: TPS6282x - Step Down Converter (Buck) with 1% Accuracy Characteristics: Vin: 2.4V ~ 5.5V Vout: 0.6V ~ 4V Output Current: 1A (TPS62821), 2A (TPS62822), 3A (TPS62823) IQ: 4μA (typ), 10μA (max) Operating Temperature: -40°C to 85°C Digikey: 296-50127-1-ND (1A) <https://www.digikey.com/product-detail/en/texas-instruments/TPS62821DLCR/296-50127-1-ND/9462910> 296-49512-1-ND (2A) <https://www.digikey.com/product-detail/en/texas-instruments/TPS62822DLCT/296-49512-1-ND/9383861> 296-50225-1-ND (3A) <https://www.digikey.com/product-detail/en/texas-instruments/TPS62823DLCT/296-50225-1-ND/9554642>; DIGIKEY: 296-49512-1-ND; DISP: TPS62822; MF: TI; MOUSER: 595-TPS62822DLCR; MPN: TPS62822DLCT
U3 = bschulz:TPS6103*: TPS6103x - High Efficiency Synchronous Boost Converter Characteristics: Vin: 1.8V ~ 5.5V Vout: 1.8V ~ 5.5V (Fixed 3.3v, 5v) Output Current (max): 4A IQ: 20μA (typ) Operating Temperature: -40°C to 85°C Digikey: 296-16660-1-ND (TPS61030, Adj) <https://www.digikey.com/products/en/integrated-circuits-ics/pmic-voltage-regulators-dc-dc-switching-regulators/739?k=tps61030&k=&pkeyword=tps61030&pv16=13128&sf=0&FV=ffe002e3%2C1c0002%2C1c0006&quantity=&ColumnSort=0&page=1&stock=1&pageSize=25> 296-16661-1-ND (TPS61031, 3.3v Fixed) <https://www.digikey.com/products/en/integrated-circuits-ics/pmic-voltage-regulators-dc-dc-switching-regulators/739?k=tps61031&k=&pkeyword=tps61031&pv7=2&pv7=6&pv16=13128&sf=0&FV=ffe002e3&quantity=&ColumnSort=0&page=1&stock=1&pageSize=25> 296-16662-1-ND (TPS61032, 5v Fixed) <https://www.digikey.com/products/en?keywords=296-16662-1-ND>; DIGIKEY: 296-16662-1-ND; DISP: TPS61032; MF: TI; MPN: TPS61032RSAR
U4 = bschulz:LT3652: LT3652 - Power Tracking Battery Charger for Solar Power (MPPT) Characteristics: Vin: 4.95V ~ 32V VBat: <14.4V Charge Current: 2A Compatable Chemistries: Li-Ion, LiPO, LiFePO4, SLA Operating Temperature: -40°C to 85°C Digikey: LT3652EDD#PBF-ND (DD) <https://www.digikey.com/product-detail/en/linear-technology-analog-devices/LT3652EDD-PBF/LT3652EDD-PBF-ND/2138757> LT3652IMSE#PBF-ND (MSE) <https://www.digikey.com/product-detail/en/linear-technology-analog-devices/LT3652IMSE-PBF/LT3652IMSE-PBF-ND/2237473>; DIGIKEY: LT3652EDD#PBF-ND; MF: LT; MPN: LT3652EDD#PBF
U5 = bschulz:BQ2980: BQ2980 - Voltage, Current, Temperature Protectors with an Integrated High-Side NFET (BMS) Characteristics: Vpack: < 20V Vdd: 1.5V ~ 5.5V Vbat: 1.5V ~ 5.5V IQ: 1μA Normal, 0.1μA Shutdown Operating Temperature: -40°C to 85°C Digikey: 296-47578-1-ND <https://www.digikey.com/product-detail/en/texas-instruments/BQ298000RUGT/296-47578-1-ND/8111032>; DIGIKEY: 296-47578-1-ND; MF: TI; MOUSER: 595-BQ298000RUGT; MPN: BQ298000RUGT
U6 = bschulz:TPS210*: TPS210x - Power Distribution Switch (OR'ing switch) Characteristics: Vin: 2.7V ~ 5.5V Iout: 500mA (In1), 100mA (In2) Ron: 250mΩ (In1), 1.3 Ω (In2) Switch Topology: 2:1 IQ: 0.75μA typ, 18μA max Operating Temperature: -40°C to 85°C TPS2104/5 Inverted vs non-inverted enable pin Digikey: TPS2105 296-10883-1-ND <https://www.digikey.com/product-detail/en/texas-instruments/TPS2105DBVR/296-10883-1-ND/504485> TPS2104 296-10882-1-ND <https://www.digikey.com/product-detail/en/texas-instruments/TPS2104DBVR/296-10882-1-ND/560870>; DIGIKEY: 296-10883-1-ND; DISP: TPS2105; MF: TI; MPN: TPS2105DBVR
U7 = bschulz:LTC4412: LTC4412 - Low Loss PowerPath Controller (ORing FET Controller) Characteristics: Vin: 2.5V ~ 28V IQ: 11μA typ Operating Temperature: -40°C to 125°C Digikey: LTC4412ES6#TRPBFCT-ND <https://www.digikey.com/product-detail/en/linear-technology-analog-devices/LTC4412ES6-TRPBF/LTC4412ES6-TRPBFCT-ND/4694482>; DIGIKEY: LTC4412ES6#TRPBFCT-ND; MF: LT; MPN: LTC4412ES6#TRPBF
U8 = bschulz:TPL5111: TPL5111 - Nano-Power System Timer for Power Gating (Watchdog, long period) Characteristics: Vdd: 1.8V ~ 5.5V IQ: 35nA (typ) Period: 100ms ~ 7200 s Operating Temperature: -40°C to 85°C Digikey: 296-46226-1-ND <https://www.digikey.com/product-detail/en/texas-instruments/TPL5111DDCR/296-46226-1-ND/7033401>; DIGIKEY: 296-46226-1-ND; MF: TI; MPN: TPL5111DDCR
U9 = bschulz:TPS797*: TPS797* - Ultra Low Power Low Dropout Linear Regulator Characteristics: Vin: 1.4V ~ 5.5V Vout: 1.8, 2.85, 3.0, 3.3V fixed IQ: 1.2μA typ, 2μA max Voltage Accuracy: 4% max Dropout Voltage: 105mV @ 10mA Output Current: 50 mA Operating Temperature: -40°C to 85°C Digikey: TPS79733 (3.3V Fixed) <https://www.digikey.com/product-detail/en/texas-instruments/TPS79733DCKR/296-11990-1-ND/390520> TPS79730 (3.0V Fixed) <https://www.digikey.com/product-detail/en/texas-instruments/TPS79730DCKR/296-11989-1-ND/390518> TPS797285 (2.85V Fixed) <https://www.digikey.com/product-detail/en/texas-instruments/TPS797285DCKR/296-25465-1-ND/2187585> TPS79718 (1.8V Fixed) <https://www.digikey.com/product-detail/en/texas-instruments/TPS79718DCKR/296-11988-1-ND/390516>; DIGIKEY: 296-11990-1-ND; DISP: TPS79733; MF: TI; MPN: TPS79733DCKR
U10 U21 U22 = bschulz:TPS22917: TPS22917 - Ultra Low Leakage Load Switch Characteristics: Vin: 1v ~ 5.5v IQ: 10nA (OFF), 0.5μA (ON) RDS(ON): 80mΩ (Vin = 5v), 90mΩ (Vin = 3.3v) Output Current: 2A Operating Temperature: -40°C to 125°C Digikey: 296-48370-1-ND <https://www.digikey.com/product-detail/en/texas-instruments/TPS22917DBVT/296-48370-1-ND/8567102>; DIGIKEY: 296-48370-1-ND; MF: TI; MPN: TPS22917DBVT
U11-U13 = bschulz:SN74AUP1G04: SN74AUP1G04 - NOT, 1 Element, 1 Input Characteristics: VCC: 0.8 ~ 3.6v IQ = 0.9μA Operating Temperature: -40°C to 85°C Digikey: 296-19072-1-ND (DCK) <https://www.digikey.com/product-detail/en/texas-instruments/SN74AUP1G04DCKR/296-19072-1-ND/864303> 296-25196-1-ND (YFP) <https://www.digikey.com/product-detail/en/texas-instruments/SN74AUP1G04YFPR/296-25196-1-ND/2172683>; DIGIKEY: 296-25196-1-ND; MF: TI; MPN: SN74AUP1G04YFPR
U14-U16 = bschulz:SN74AUP2G08: SN74AUP2G08 - AND, 2 Element, 2 Input Characteristics: VCC: 0.8 ~ 3.6v IQ = 0.9μA Operating Temperature: -40°C to 85°C Digikey: 296-25638-1-ND (DQE) <https://www.digikey.com/product-detail/en/texas-instruments/SN74AUP2G08DQER/296-25638-1-ND/2202460>; DIGIKEY: 296-25638-1-ND; MF: TI; MPN: SN74AUP2G08DQER
U17-U20 = bschulz:MIC2544: MIC2544/48 - Hight Side Load Switch, with Adjustable Current Limit Characteristics: Vin: 2.7v ~ 5.5v IQ: 1μA (OFF) RDS(ON): 80mΩ (Vin = 5v) Output Current: 1.5A (Max, limit adj) Operating Temperature: -40°C to 85°C Digikey: 576-1738-5-ND (Active High, MSOP) <https://www.digikey.com/product-detail/en/microchip-technology/MIC2544-1YMM/576-1738-5-ND/1028557> 576-1739-5-ND (Active Low, MSOP) <https://www.digikey.com/product-detail/en/microchip-technology/MIC2544-2YMM/576-1739-5-ND/1028565>; DIGIKEY: 576-1738-5-ND; MF: Microchip; MPN: MIC2544-1YMM
U23 = bschulz:FT231X: FT231x - USB to UART Bridge Characteristics: Vin: 3.3V ~ 5V Operating Temperature: -40°C to 85°C Digikey: FT231x <https://www.digikey.com/product-detail/en/ftdi-future-technology-devices-international-ltd/FT231XQ-R/768-1128-1-ND/3029153>; DIGIKEY: 768-1128-1-ND; MF: FTDI; MPN: FT231XQ-R
U24 = bschulz:SN74LVC1G3157: SN74LVC1G3157 - SPDT Analog Switch Characteristics: VCC: 1.65~5.5V Operating Temperature: -40°C to 85°C On state resistace: 15 Ω, Max Channel to Channel Matching: 0.1 Ω, Typical Digikey: 296-14909-1-ND (SC70, DCK) <https://www.digikey.com/product-detail/en/texas-instruments/SN74LVC1G3157DCKR/296-14909-1-ND/562526> 296-18015-1-ND (SOT-666, DRL) <https://www.digikey.com/product-detail/en/texas-instruments/SN74LVC1G3157DRLR/296-18015-1-ND/770530>; DIGIKEY: 296-18015-1-ND; DISP: SN74LVC1G3157; MF: TI; MPN: SN74LVC1G3157DRLR
U25 = bschulz:SN74AUP3G34: SN74AUP3G34 - Logic Buffer Characteristics: VCC: 0.8~3.6V Operating Temperature: -40°C to 85°C Number of Gates: 3 /li> Inverting: No Digikey: 296-27503-1-ND (UQFN, RSE) <https://www.digikey.com/scripts/DkSearch/dksus.dll?Detail&itemSeq=257211059&uq=636588853324239862> 296-36973-1-ND (XFDFN, DQE) <https://www.digikey.com/product-detail/en/texas-instruments/SN74AUP3G34DQER/296-36973-1-ND/4428921> 296-25595-1-ND (VFSOP, DCU) <https://www.digikey.com/product-detail/en/texas-instruments/SN74AUP3G34DCUR/296-25595-1-ND/2202056>; DIGIKEY: 296-25595-1-ND; MF: TI; MPN: SN74AUP3G34DCUR
U26 = bschulz:TXS0102: TXS0102 - 2 Channel Bidirectional Voltage Level Translator Characteristics: Vcc: 1.65 ~ 3.6V (Port A), 2.3 ~ 5.5V (Port B) IQ: 14.4μA Output Current: 50mA Output Type: Open Drain/Push-Pull Operating Temperature: -40°C to 85°C Digikey: 296-28368-1-ND (DQE) <https://www.digikey.com/product-detail/en/texas-instruments/TXS0102DQER/296-28368-1-ND/2625893> 296-28435-1-ND (DQM) <https://www.digikey.com/product-detail/en/texas-instruments/TXS0102DQMR/296-28435-1-ND/2638910> 296-21931-1-ND (DCU) <https://www.digikey.com/product-detail/en/texas-instruments/TXS0102DCUR/296-21931-1-ND/1629284>; DIGIKEY: 296-28435-1-ND; MF: TI; MPN: TXS0102DQMR
U27 U29 U42 = bschulz:TXS0104: TXS0104 - 4 Channel Bidirectional Voltage Level Translator Characteristics: Vcc: 1.65 ~ 3.6V (Port A), 2.3 ~ 5.5V (Port B) IQ: 14.4μA Output Current: 50mA Output Type: Open Drain/Push-Pull Operating Temperature: -40°C to 85°C Digikey: 296-20698-1-ND (RGY) <https://www.digikey.com/product-detail/en/texas-instruments/TXS0104ERGYR/296-20698-1-ND/1143682>; DIGIKEY: 296-20698-1-ND; MF: TI; MPN: TXS0104ERGYR
U28 U36 = bschulz:TCA9406: TCA9406 - I2C Bidirectional 1MHz Logic Level Translator Characteristics: Vcc: 1.65V ~ 5.5V IOut: 25 mA IQ: 14.4μA Operating Temperature: -40°C to 85°C Internal Pullups: 10kΩ Digikey: 296-28109-1-ND (VSSOP, DCU) <https://www.digikey.com/product-detail/en/texas-instruments/TCA9406DCUR/296-28109-1-ND/2510735> 296-28108-1-ND (SM8, DCT) <https://www.digikey.com/product-detail/en/texas-instruments/TCA9406DCTR/296-28108-1-ND/2510734>; DIGIKEY: 296-28109-1-ND; MF: TI; MPN: TCA9406DCUR
U30 = bschulz:MCP4726*: MCP4726x - 8/10/12 Bit Digital to Analog Converter Characteristics: VCC: 2.7~5.5V IQ: 210μA (On), 60nA (Shutdown) Operating Temperature: -40°C to 125°C Number of Outputs: 1 Settling Time: 6μs Number of Bits: 8 (MCP4706), 10 (MCP4716), 12 (MCP4726) Digikey: MCP4726A0T-E/CHCT-ND (MCP4726, A0) <https://www.digikey.com/product-detail/en/microchip-technology/MCP4726A0T-E-CH/MCP4726A0T-E-CHCT-ND/2713266> MCP4726A1T-E/CHCT-ND (MCP4726, A1) <https://www.digikey.com/product-detail/en/microchip-technology/MCP4726A1T-E-CH/MCP4726A1T-E-CHCT-ND/5148848> MCP4726A2T-E/CHCT-ND (MCP4726, A2) <https://www.digikey.com/product-detail/en/microchip-technology/MCP4726A2T-E-CH/MCP4726A2T-E-CHCT-ND/8638162> MCP4726A3T-E/CHCT-ND (MCP4726, A3) <https://www.digikey.com/product-detail/en/microchip-technology/MCP4726A3T-E-CH/MCP4726A3T-E-CHCT-ND/7065582>; DIGIKEY: MCP4726A2T-E/CHCT-ND; DISP: MCP4726A2; MF: Microchip; MPN: MCP4726A2T-E/CH
U31 = bschulz:BME280: BME280 - Combined Digital Humidity and Pressure Sensor Characteristics: Vcc: 1.8V ~ 3.3V Pressure Range: 300 ~ 1100 mBar Pressure Resolution: 0.0015 mBar, max Pressure Accuracy: relative ±0.12 mBar, abs ± 1 mBar Humidity Resolution: 0.008% RH, max Humidity Accuracy: ±3% RH Temperature Resolution: 0.01°C Temperature Accuracy: 0.5°C Operating Temperature: -40°C to 85°C Digikey: 828-1063-1-ND <https://www.digikey.com/product-detail/en/bosch-sensortec/BME280/828-1063-1-ND/6136314>; DIGIKEY: 828-1063-1-ND; DISP: BME280; MF: Bosch; MPN: BME280
U32 U33 = bschulz:ADS111*: ADS1115 - Sigma Delta ADC Characteristics: VCC: 2~5.5V Resolution: 16 bits (12 bits for ADS1015) Number of Inputs: 4 (2 Differenital) Sample Rate: 860 Samples Per Second (3300 for ADS1015) Operating Temperature: -40°C to 125°C Digikey: 296-38849-1-ND (ADS1115) <https://www.digikey.com/scripts/DkSearch/dksus.dll?Detail&itemSeq=258904888&uq=636603311183646020> 296-41185-1-ND (ADS1015) <https://www.digikey.com/product-detail/en/texas-instruments/ADS1015IDGSR/296-41185-1-ND/5222640>; DIGIKEY: 296-38849-1-ND; MF: TI; MPN: ADS1115IDGSR
U34 = bschulz:INA21*: INA21x - Analog Output Current Sense Amplifier Characteristics: Vs: 2.7V ~ 26V Iq: 100uA Common Mode Range: 0V ~ 26V Gain: 200, 500, 1000, 50, 100, 75 V/V (INA210, 211, 212, 213, 214, 215) Operating Temperature: -40°C to 125°C Digikey: INA210 <https://www.digikey.com/product-detail/en/texas-instruments/INA210BIDCKR/296-40124-1-ND/5178001> INA211 <https://www.digikey.com/product-detail/en/texas-instruments/INA211BIDCKR/296-40126-1-ND/5178003> INA212 <https://www.digikey.com/product-detail/en/texas-instruments/INA212BIDCKR/296-40128-1-ND/5178005> INA213 <https://www.digikey.com/product-detail/en/texas-instruments/INA213BIDCKR/296-40129-1-ND/5178006> INA214 <https://www.digikey.com/product-detail/en/texas-instruments/INA214BIDCKR/296-40131-1-ND/5178008> INA215 <https://www.digikey.com/product-detail/en/texas-instruments/INA215AIDCKR/296-46095-1-ND/7033271>; DIGIKEY: 296-40126-1-ND; DISP: INA211; MF: TI; MPN: INA211BIDCKR
U35 = bschulz:INA21*: INA21x - Analog Output Current Sense Amplifier Characteristics: Vs: 2.7V ~ 26V Iq: 100uA Common Mode Range: 0V ~ 26V Gain: 200, 500, 1000, 50, 100, 75 V/V (INA210, 211, 212, 213, 214, 215) Operating Temperature: -40°C to 125°C Digikey: INA210 <https://www.digikey.com/product-detail/en/texas-instruments/INA210BIDCKR/296-40124-1-ND/5178001> INA211 <https://www.digikey.com/product-detail/en/texas-instruments/INA211BIDCKR/296-40126-1-ND/5178003> INA212 <https://www.digikey.com/product-detail/en/texas-instruments/INA212BIDCKR/296-40128-1-ND/5178005> INA213 <https://www.digikey.com/product-detail/en/texas-instruments/INA213BIDCKR/296-40129-1-ND/5178006> INA214 <https://www.digikey.com/product-detail/en/texas-instruments/INA214BIDCKR/296-40131-1-ND/5178008> INA215 <https://www.digikey.com/product-detail/en/texas-instruments/INA215AIDCKR/296-46095-1-ND/7033271>; DIGIKEY: 296-40129-1-ND; DISP: INA213; MF: TI; MPN: INA213BIDCKR
U37 = bschulz:TLV3691: TLV3691 - Nanopower Analog Comparator Characteristics: Vin: 0.9V ~ 6.5V (± 0.45V ~ ± 3.25V) Response Time: 24us Push-Pull Output IQ: 75nA Operating Temperature: -40°C to 125°C Digikey: 296-37910-1-ND (DCK) <https://www.digikey.com/products/en/integrated-circuits-ics/linear-comparators/692?k=TLV3691&k=&pkeyword=TLV3691&sv=0&pv7=2&sf=0&FV=142c0371%2Cffe002b4&quantity=&ColumnSort=1000011&page=1&stock=1&pageSize=25> 296-37242-6-ND (DPF) <https://www.digikey.com/product-detail/en/texas-instruments/TLV3691IDPFR/296-37242-6-ND/4695352>; DIGIKEY: 296-37910-1-ND; MF: TI; MPN: TLV3691IDCKR
U38 = bschulz:TS5A21366: TS5A21366 - 2 Channel SPST Analog Switch Characteristics: VCC: 1.65~5.5V Operating Temperature: -40°C to 85°C On state resistace: 0.75 Ω, Typ Channel to Channel Matching: 0.04 Ω, Typical Digikey: 296-24304-1-ND (US8, DCU) <https://www.digikey.com/product-detail/en/texas-instruments/TS5A21366DCUR/296-24304-1-ND/2039822> 296-25285-1-ND (UFQFN, RSE) <https://www.digikey.com/product-detail/en/texas-instruments/TS5A21366RSER/296-25285-1-ND/2178186>; DIGIKEY: 296-25285-1-ND; DISP: TS5A21366; MF: TI; MPN: TS5A21366RSER
U39 = bschulz:MIC9409*: MIC9409x - Hight Side Load Switch Characteristics: Vin: 1.7V ~ 5.5V IQ: 0.1μA typ, 1μA max RDS(ON): 130mΩ (Vin = 5v), 140mΩ (Vin = 3.6v) Output Current: 1.2A Operating Temperature: -40°C to 125°C Digikey: 576-3484-1-ND <https://www.digikey.com/products/en/integrated-circuits-ics/pmic-power-distribution-switches-load-drivers/726?k=mic94090&k=&pkeyword=mic94090&pv1291=38&sf=0&FV=ffe002d6%2C1c0002&quantity=&ColumnSort=0&page=1&stock=1&pageSize=25>; DIGIKEY: 576-3492-1-ND; DISP: MIC94094; MF: Microchip; MPN: MIC94094YC6-TR
U40 = bschulz:SN74AHC1G86: SN74AHC1G86 - XOR, 1 Element, 2 Input Characteristics: VCC: 2 ~ 6V IQ = 1μA Operating Temperature: -40°C to 85°C Digikey: 296-8750-1-ND (SC-70) <https://www.digikey.com/product-detail/en/texas-instruments/SN74AHC1G86DCKR/296-8750-1-ND/373813>; DIGIKEY: 296-8750-1-ND; MF: TI; MPN: SN74AHC1G86DCKR
U41 = bschulz:MCP23018: MCP23018 - I2C I/O Expander, 16 bit wtih interrupt and reset Characteristics: Vcc: 1.8V ~ 5.5V IOut: 25 mA IQ: 1μA Operating Temperature: -40°C to 85°C Internal Configurable Pullups Digikey: MCP23018T-E/MJCT-ND (QFN) <https://www.digikey.com/products/en/integrated-circuits-ics/interface-i-o-expanders/749?k=mcp23018&k=&pkeyword=mcp23018&sv=0&pv1291=4438&sf=0&FV=ffe002ed%2C1c0002%2C1140003&quantity=&ColumnSort=0&page=1&stock=1&pageSize=25>; DIGIKEY: MCP23018T-E/MJCT-ND; MF: TI; MPN: MCP23018T-E/MJ
U$1 U$2 = awickert:VDIV-JP
USB1 = bschulz:MICRO_USB_LONGPADS; DIGIKEY: 609-4618-1-ND; MF: Amphenol; MPN: 10118194-0001LF
XTAL1 = bschulz:CRYSTAL: Crystal Oscilator 2 Pin quartz crystal oscilators Variants 3.2x1.5mm (Only available in 32.768kHz) <https://www.digikey.com/products/en/crystals-oscillators-resonators/crystals/171?FV=b839bf%2Cb83a33%2C8640001%2C864000f%2C8640003%2C1f140000%2Cmu32.768kHz%7C2150%2Cffe000ab&quantity=10&ColumnSort=1000011&page=1&stock=1&k=crystal&pageSize=25&pkeyword=crystal> 5 x 3.2mm (8MHz ~ 50MHz) <https://www.digikey.com/products/en/crystals-oscillators-resonators/crystals/171?FV=402f3e%2Cb8434d%2C1f140000%2Cffe000ab&quantity=10&ColumnSort=1000011&page=1&stock=1&pageSize=25>; DIGIKEY: 887-1740-1-ND; MF: TXC; MPN: 7A-8.000MAAE-T